# EAGLE schematic ESP32-P4 Display 7.0 inch V1.2 (EAGLE 9.6.2)
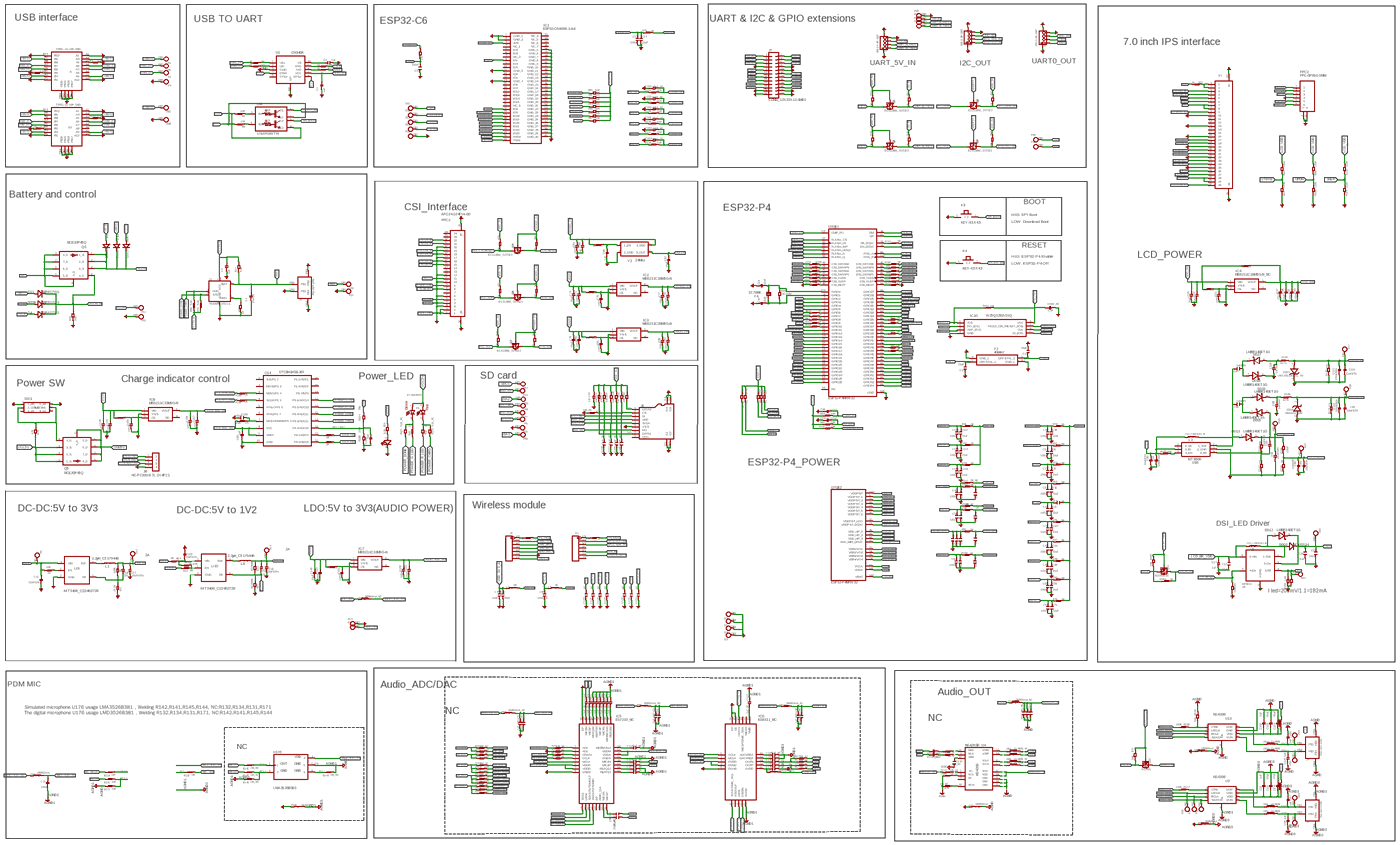
[diagram p0: schematic, sheet 1, overview]
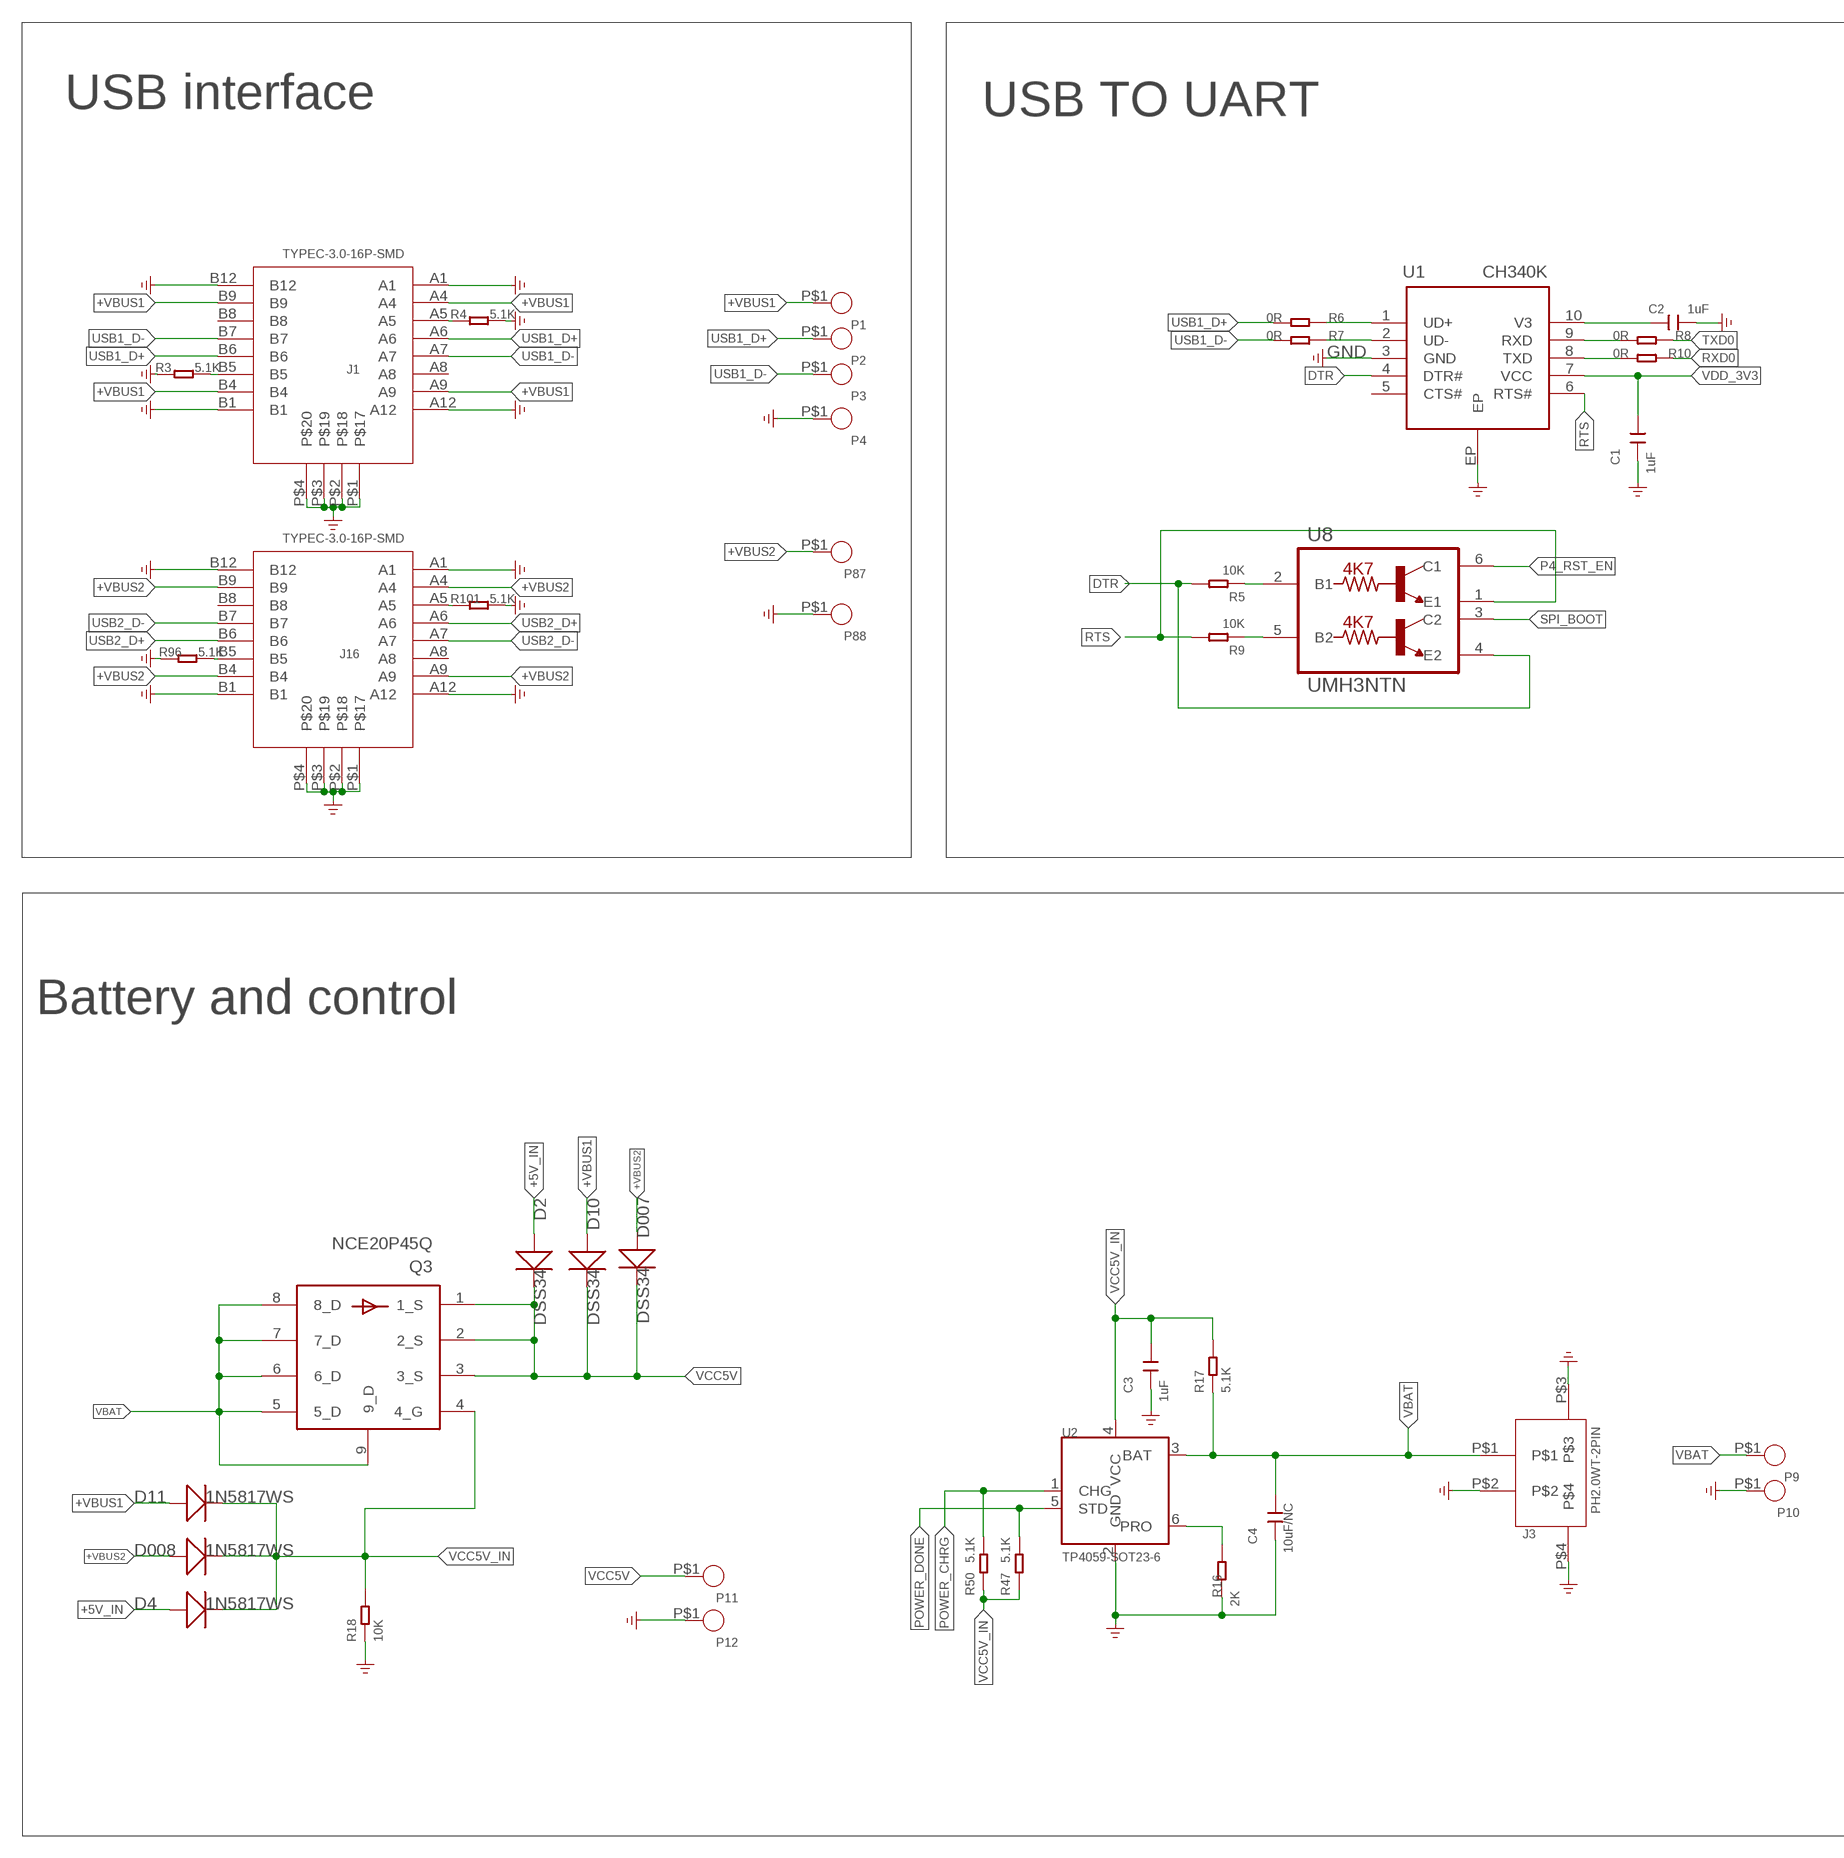
[diagram p1: schematic, sheet 1, part 1 of 8]
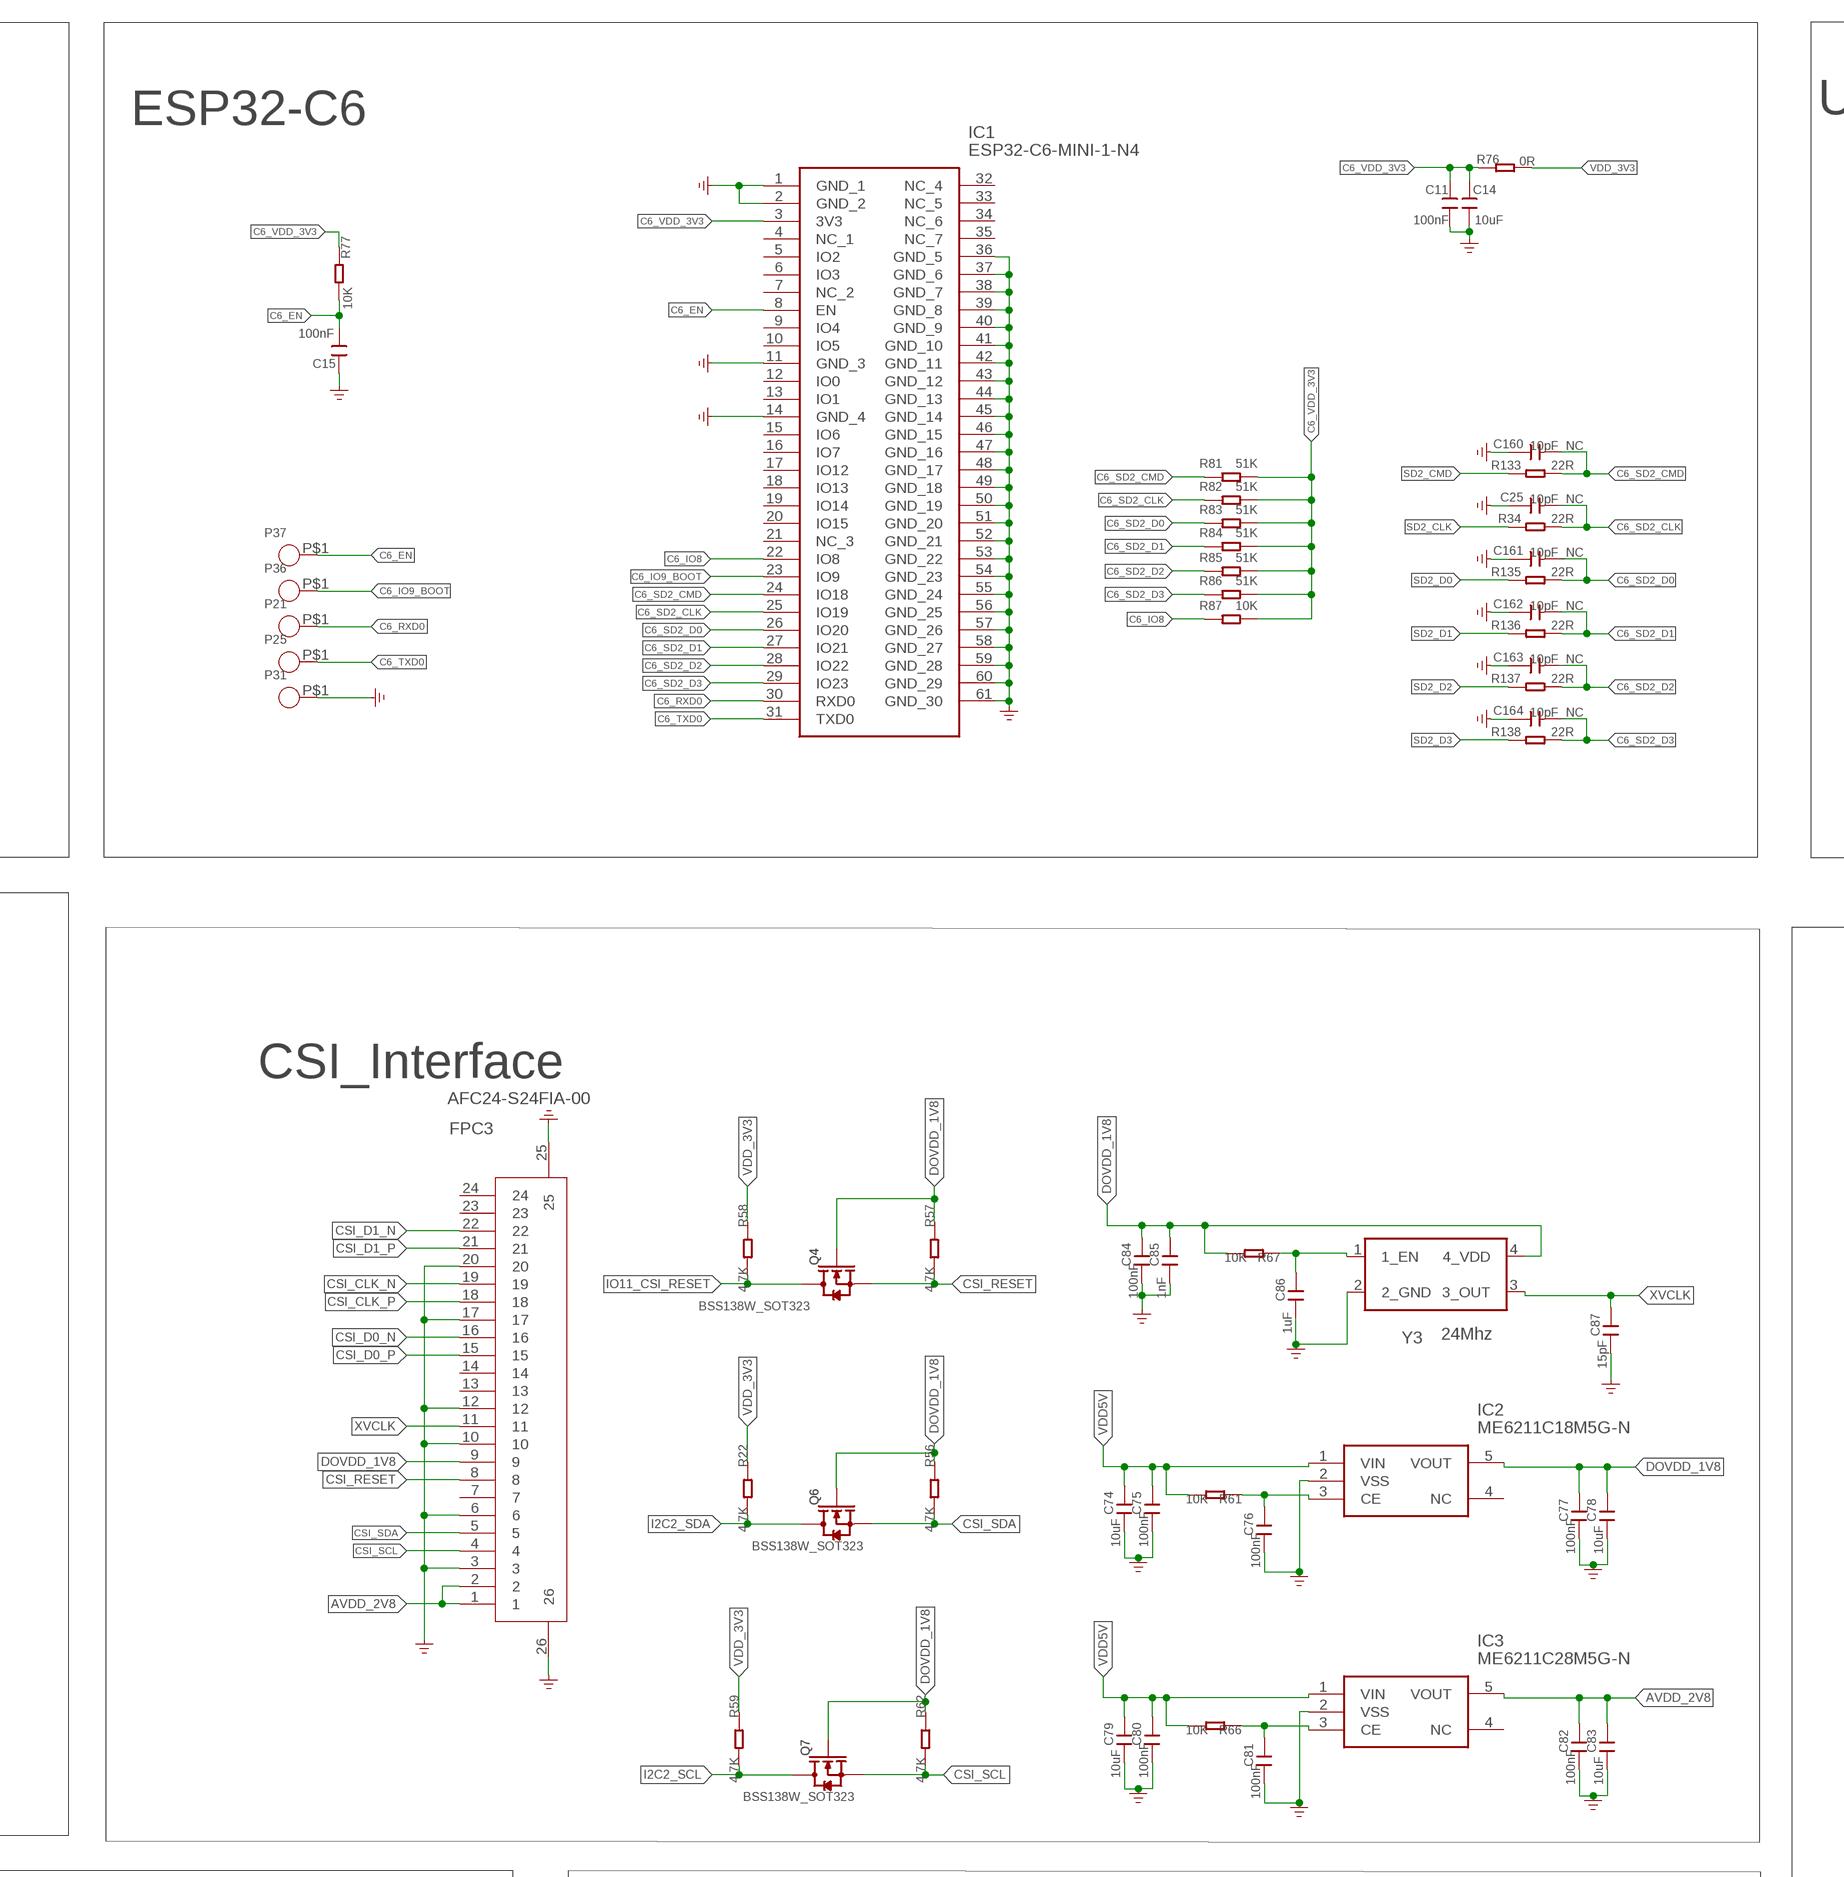
[diagram p2: schematic, sheet 1, part 2 of 8]
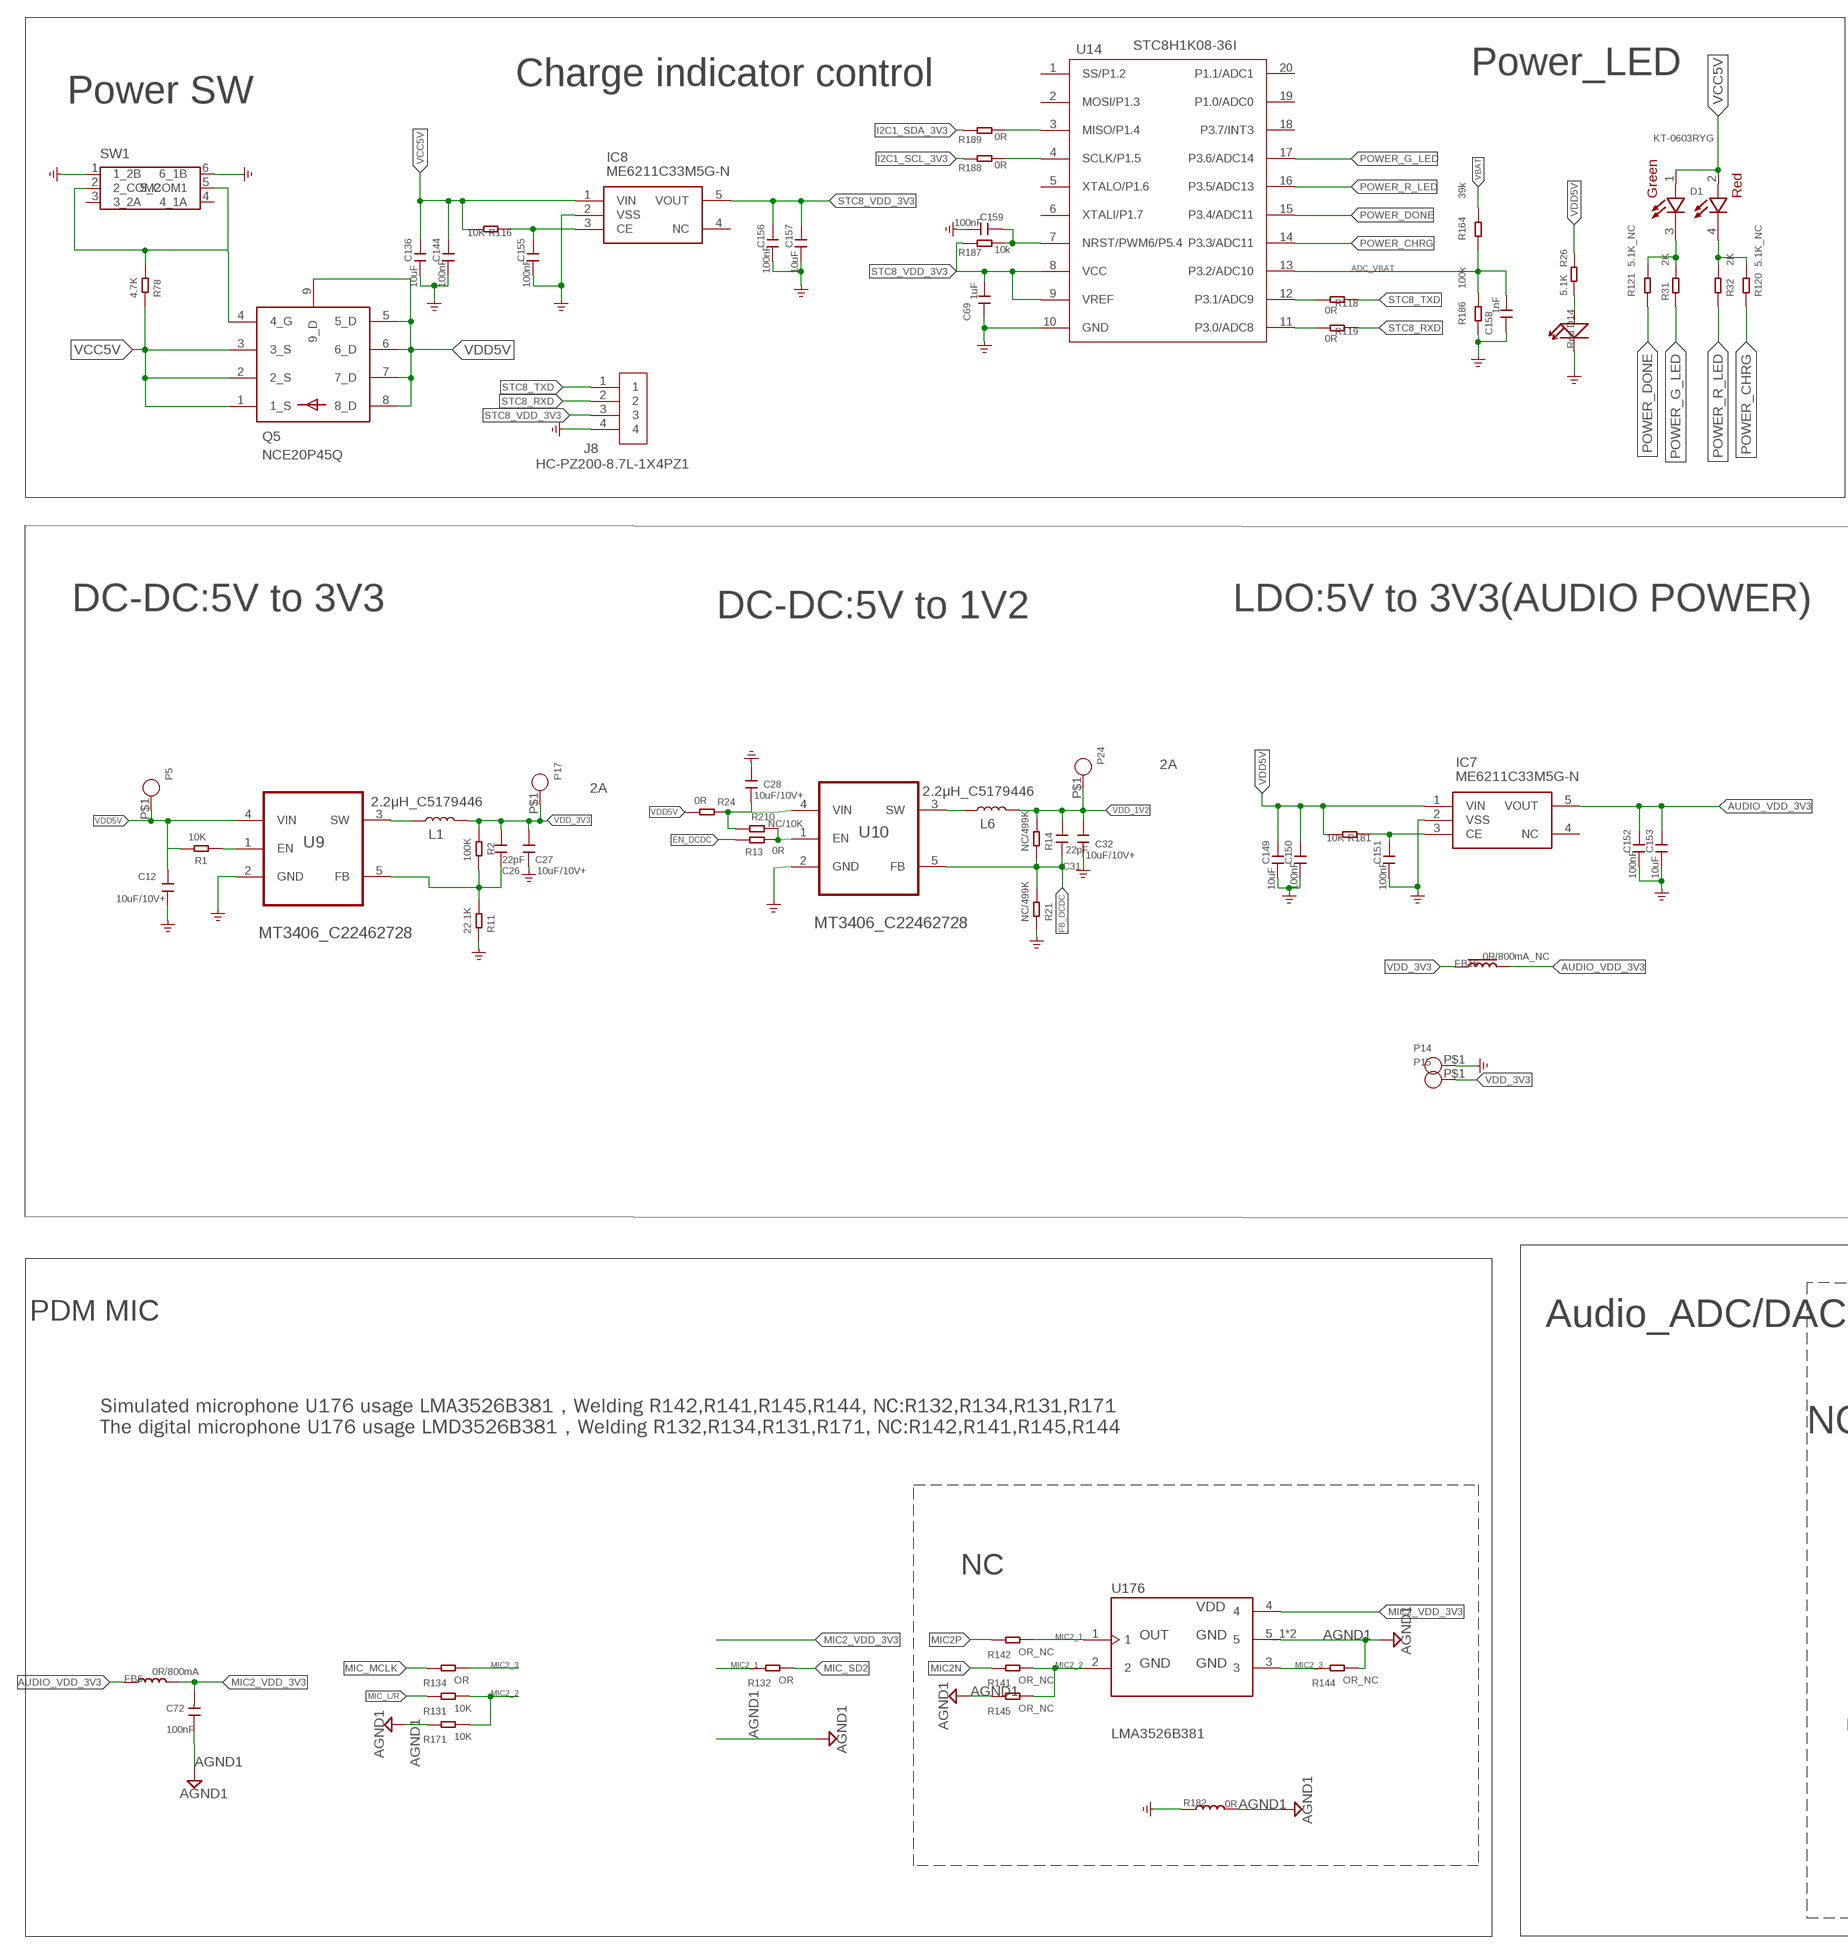
[diagram p3: schematic, sheet 1, part 3 of 8]
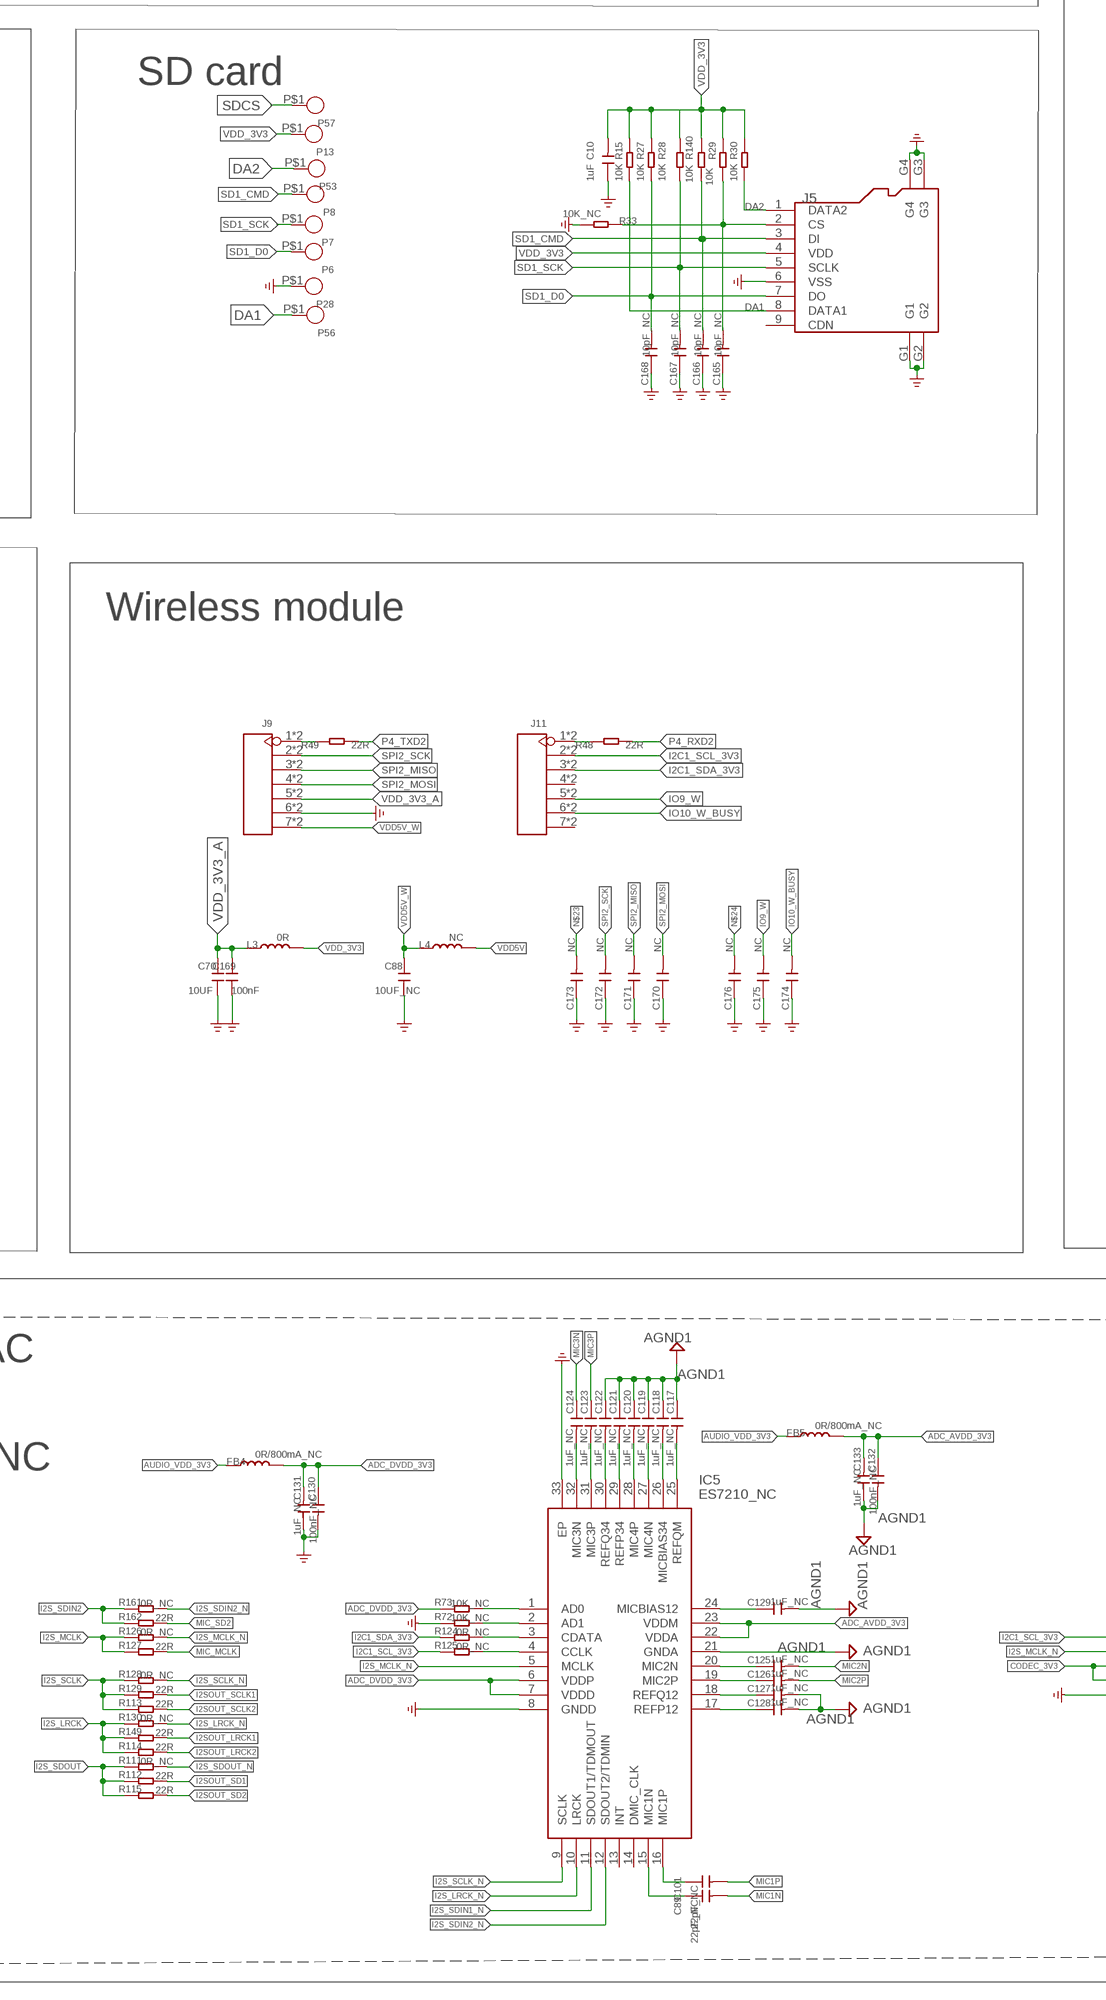
[diagram p4: schematic, sheet 1, part 4 of 8]
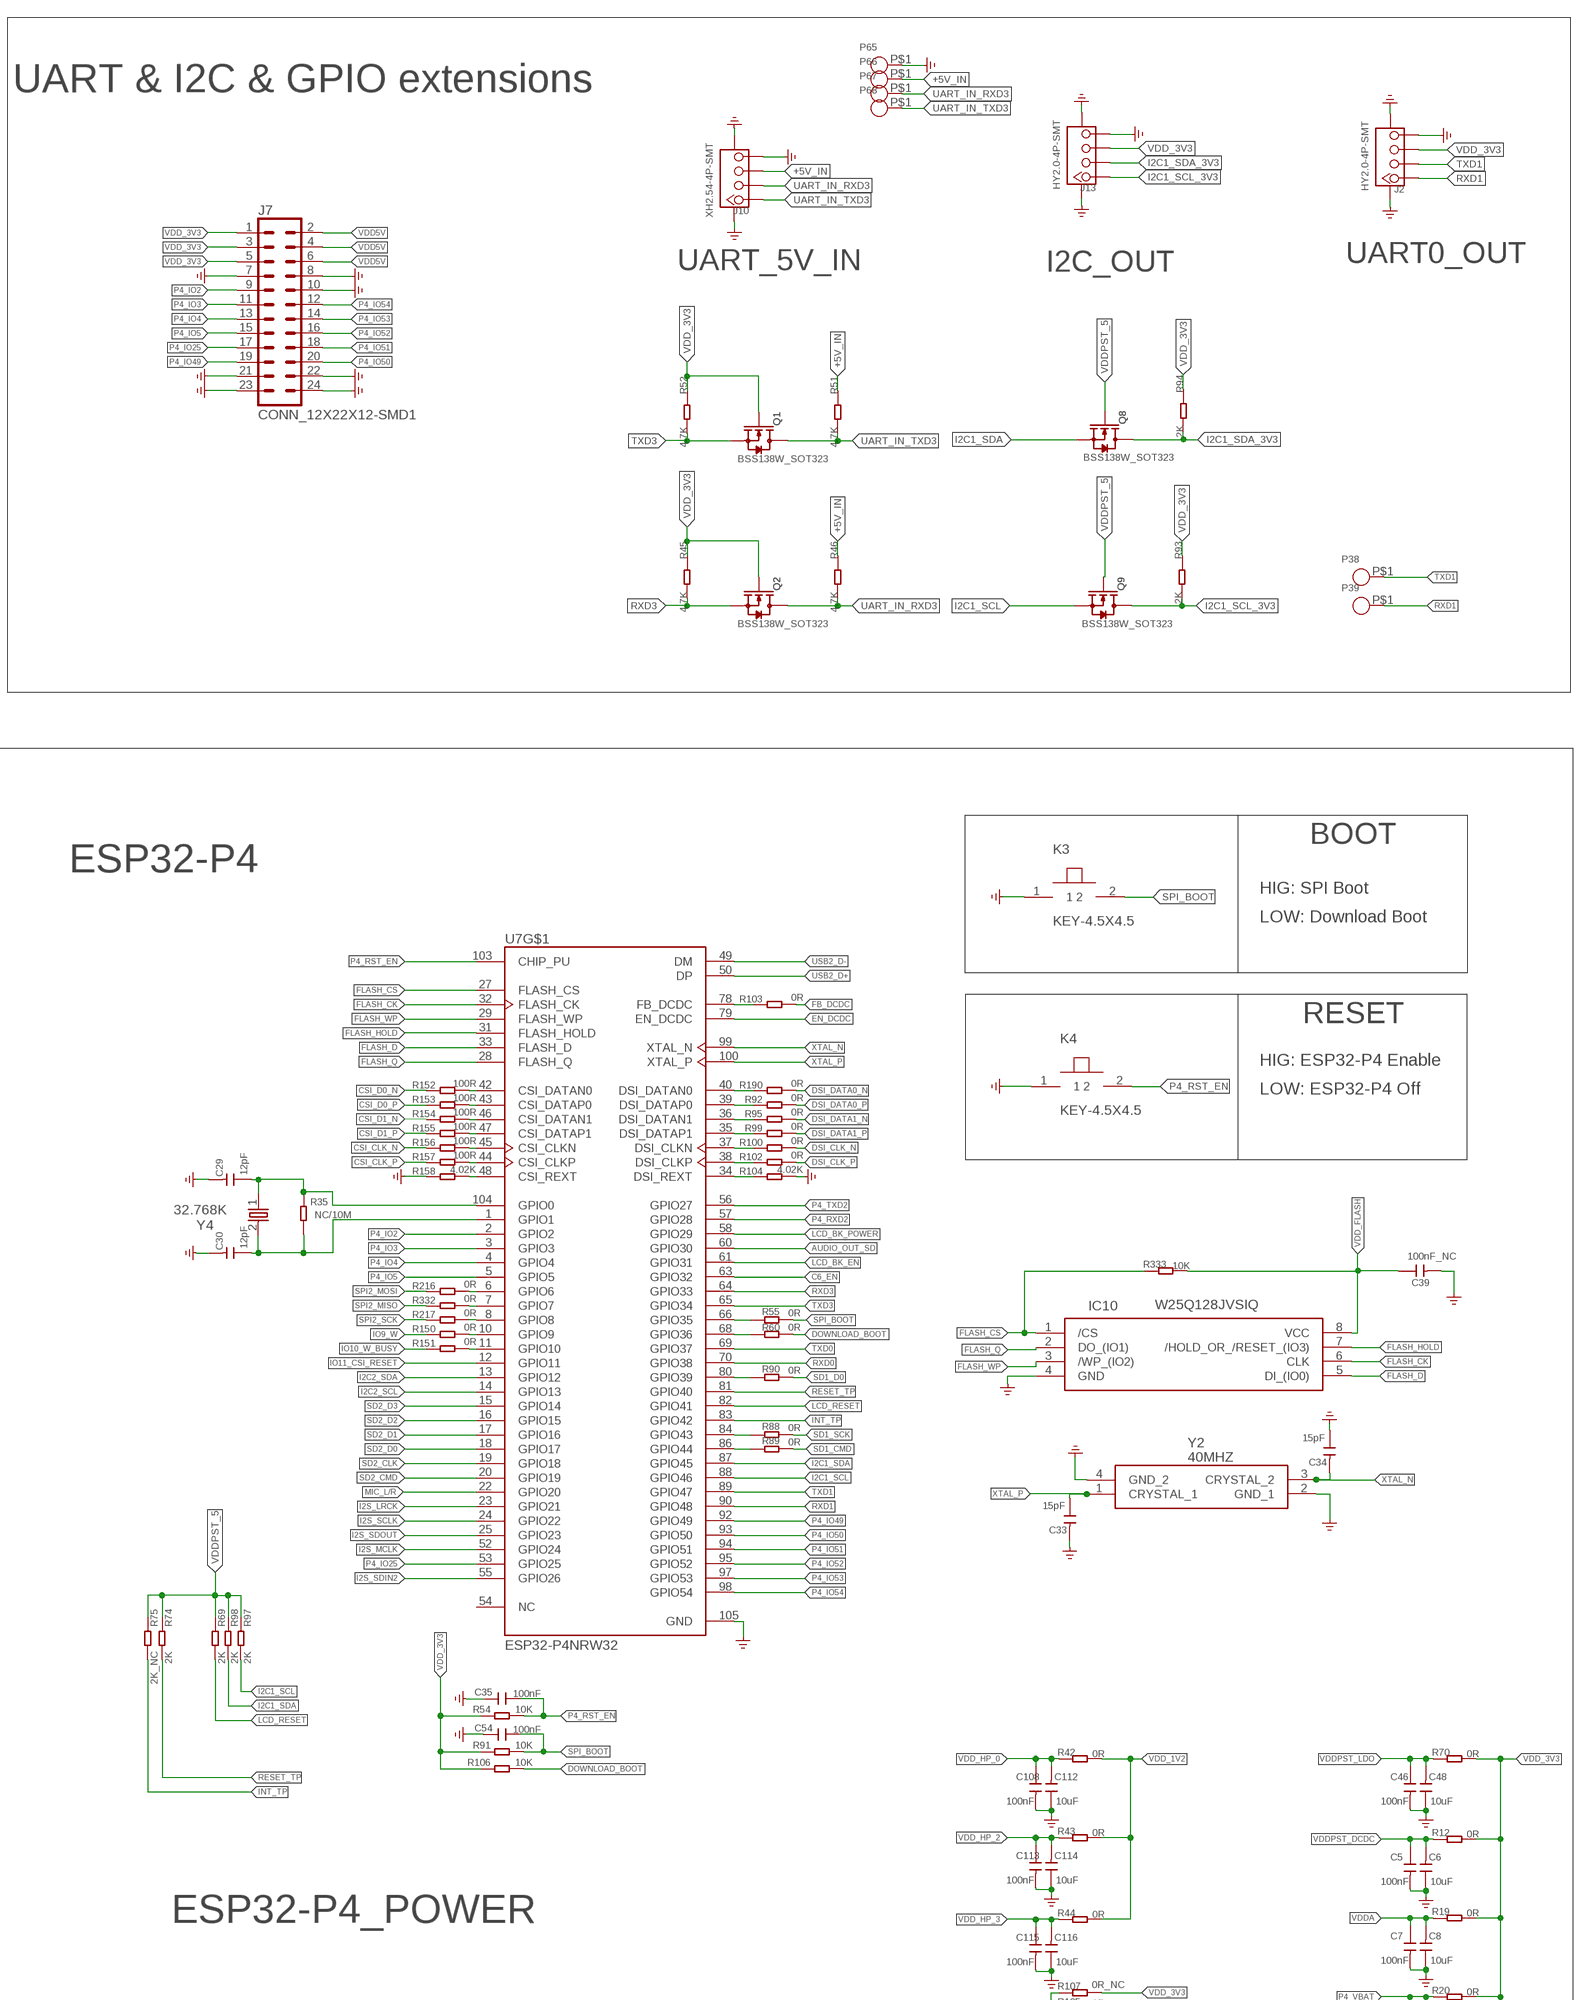
[diagram p5: schematic, sheet 1, part 5 of 8]
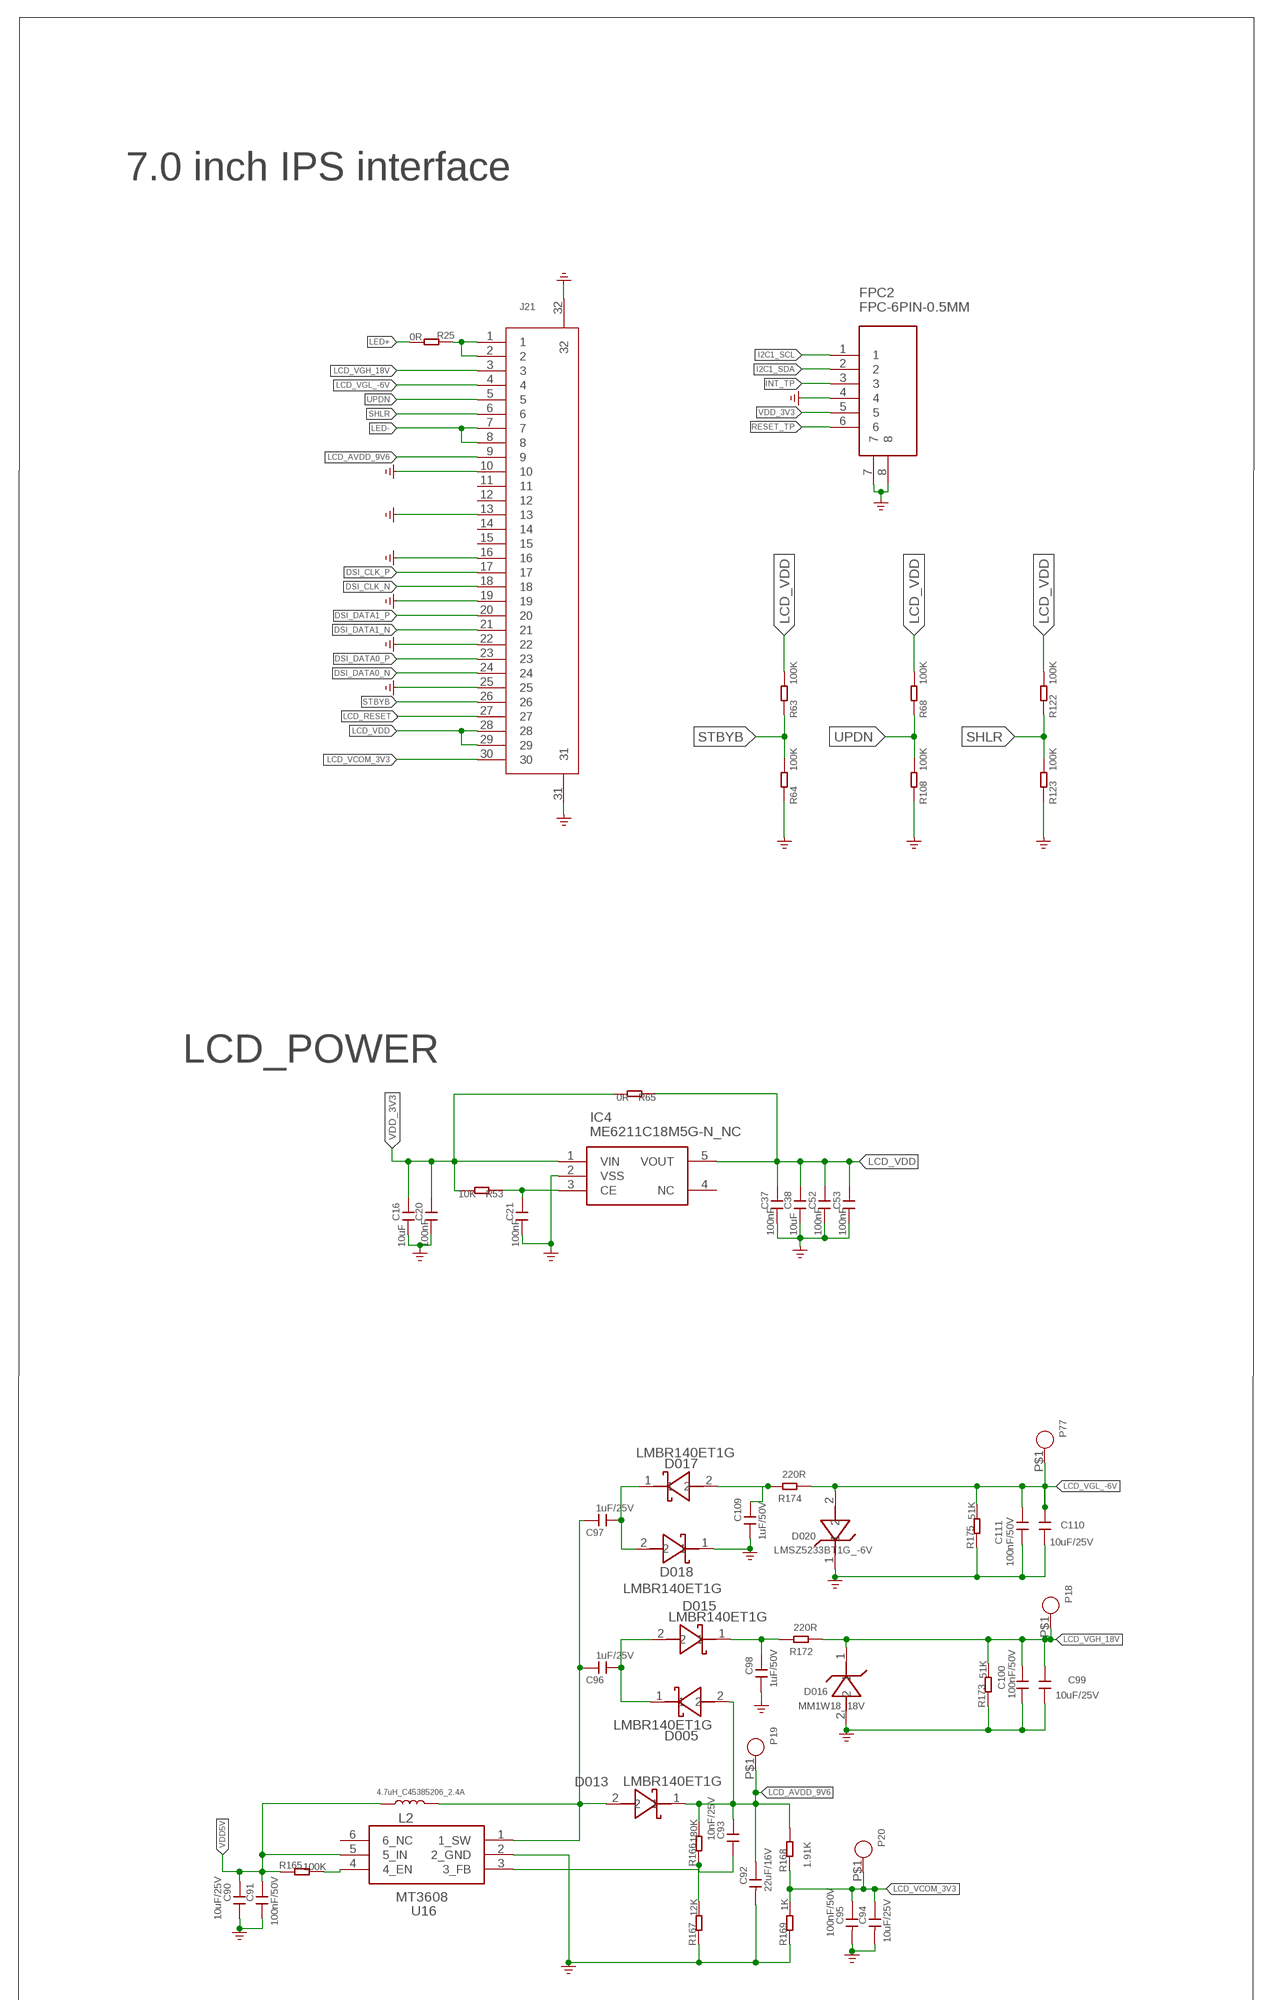
[diagram p6: schematic, sheet 1, part 6 of 8]
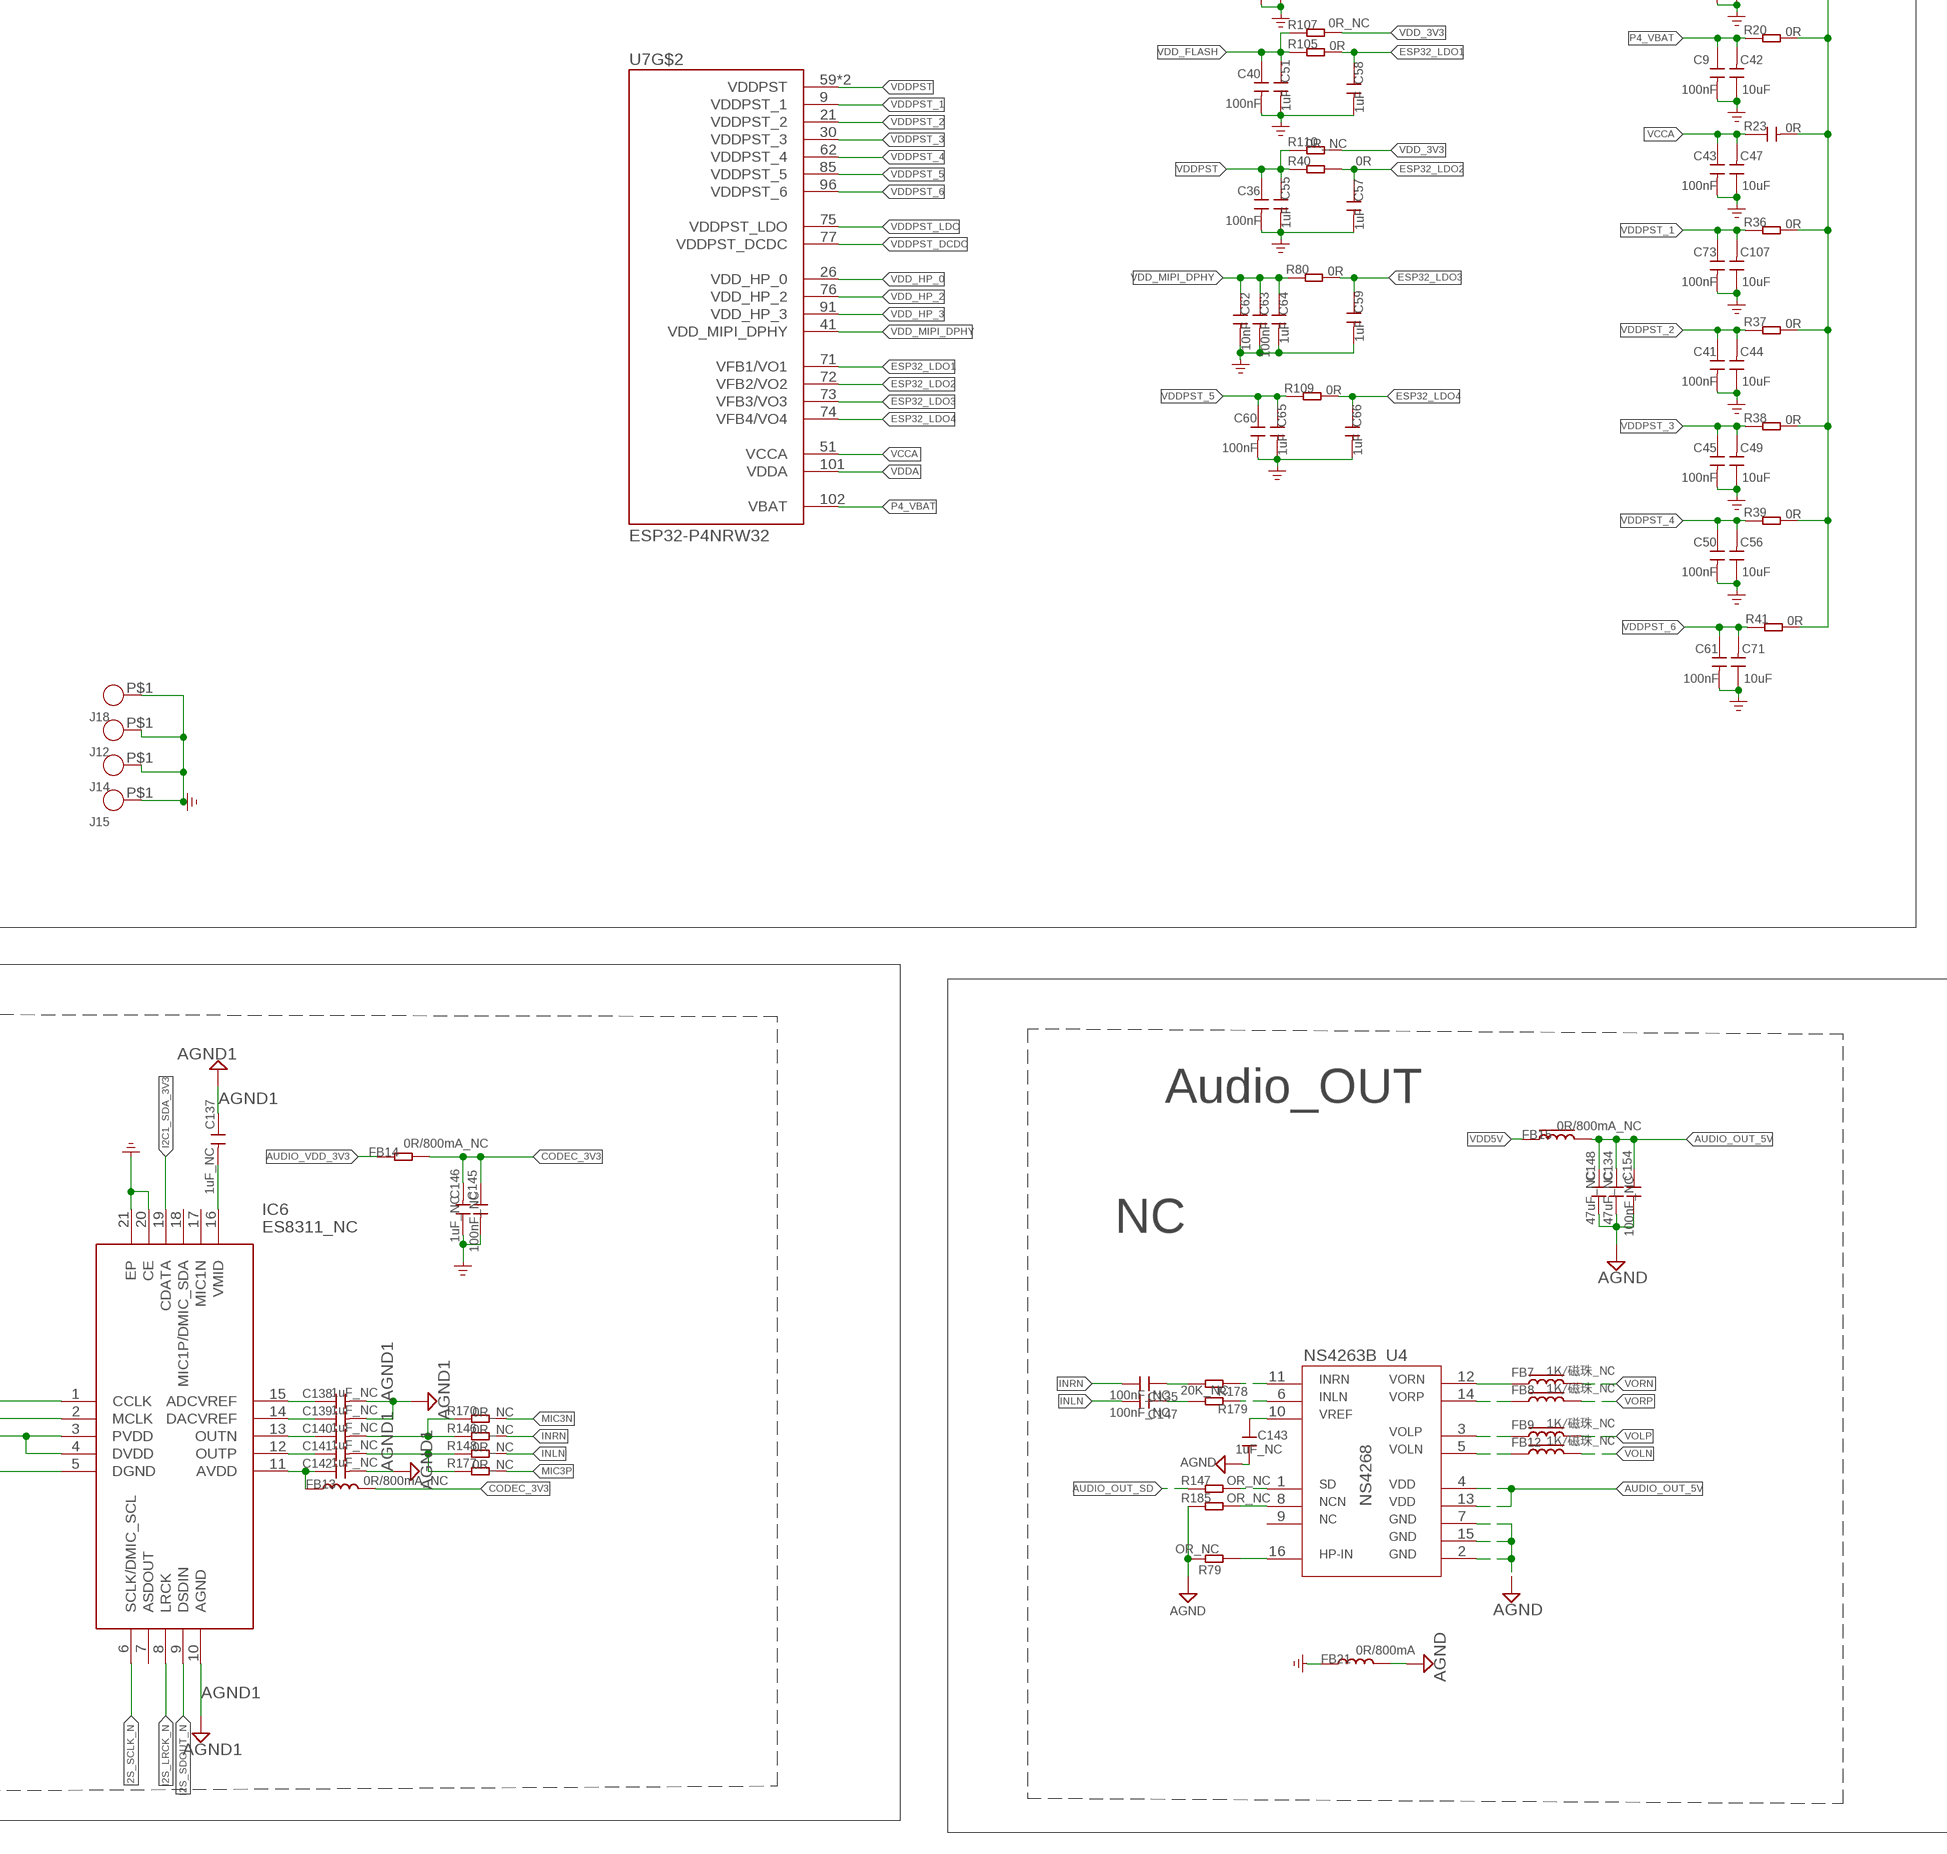
[diagram p7: schematic, sheet 1, part 7 of 8]
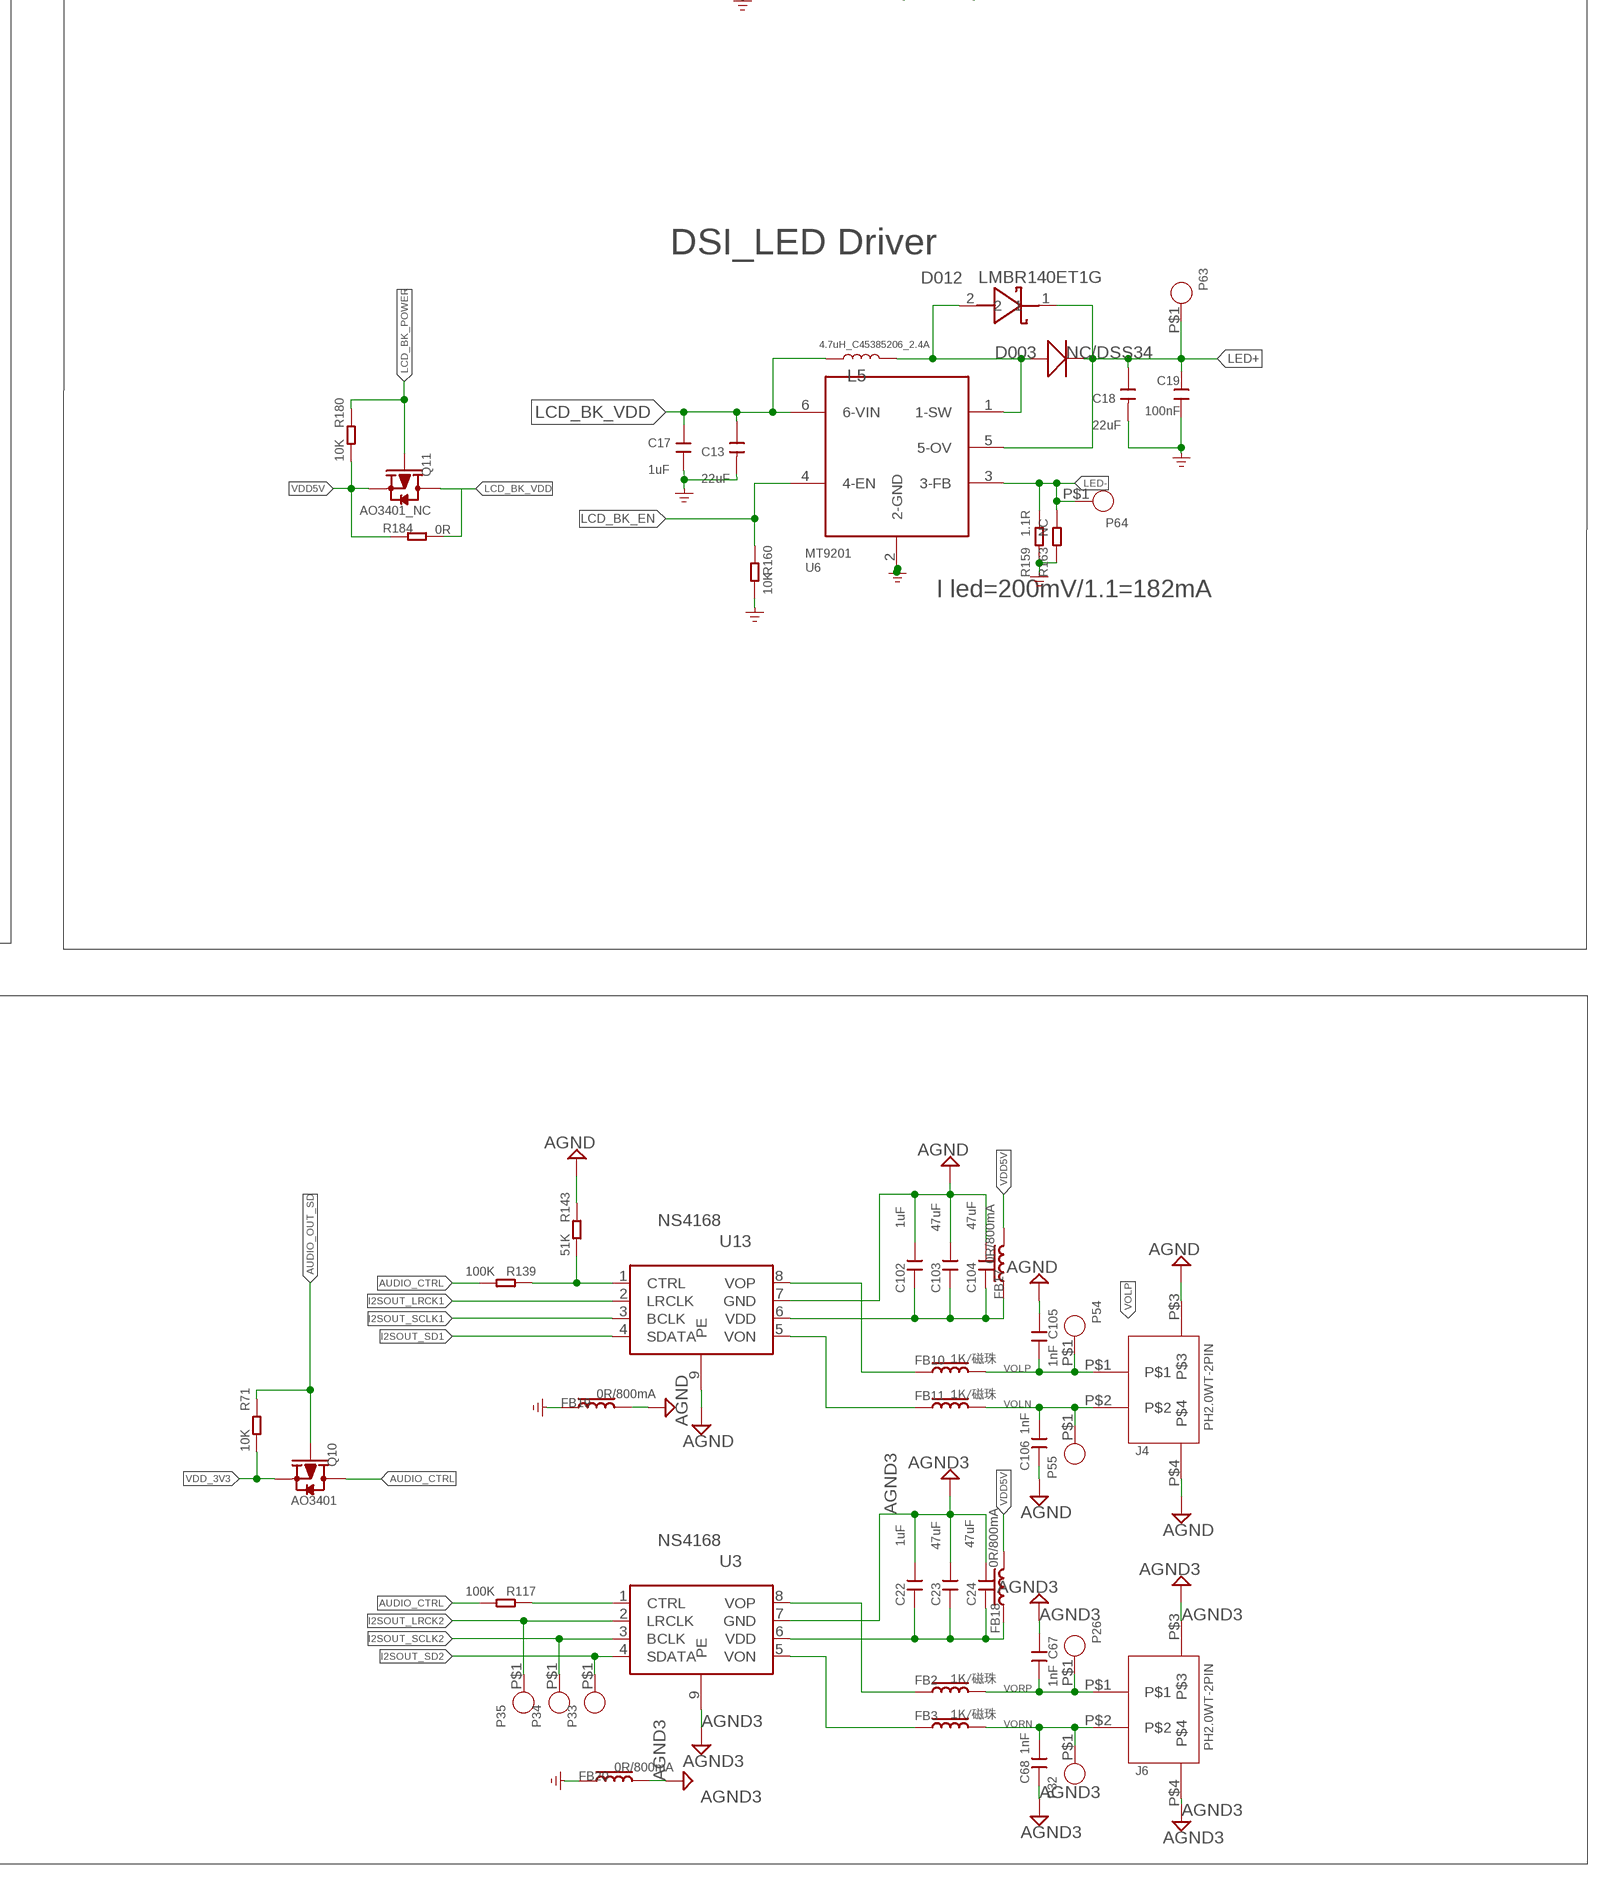
[diagram p8: schematic, sheet 1, part 8 of 8]

## Parts
C1  1uF  C0603  [0603]
C2  1uF  C0603  [0603]
C3  1uF  C0603  [0603]
C4  10uF/NC  C0603  [0603]
C5  100nF  CAPC0402-1  [C0402]
C6  10uF  CAPC0402-1  [C0402]
C7  100nF  CAPC0402-1  [C0402]
C8  10uF  CAPC0402-1  [C0402]
C9  100nF  CAPC0402-1  [C0402]
C10  1uF  CAP-0603  [DISCRETE-NEW_C0603]
C11  100nF  C0603  [0603]
C12  10uF/10V+  C0603  [0603]
C13  22uF  C0805  [C0805]
C14  10uF  C0603  [0603]
C15  100nF  C0603  [0603]
C16  10uF  C0603  [0603]
C17  1uF  C0603  [0603]
C18  22uF  C0805  [C0805]
C19  100nF  C0603  [0603]
C20  100nF  C0603  [0603]
C21  100nF  C0603  [0603]
C22  1uF  C0603  [0603]
C23  47uF  C0603  [0603]
C24  47uF  C0603  [0603]
C25  10pF_NC  CAP  [C0402]
C26  22pF  C0603  [0603]
C27  10uF/10V+  C0603  [0603]
C28  10uF/10V+  C0603  [0603]
C29  12pF  CAPC0402-1  [C0402]
C30  12pF  CAPC0402-1  [C0402]
C31  22pF  C0603  [0603]
C32  10uF/10V+  C0603  [0603]
C33  15pF  CAPC0402-1  [C0402]
C34  15pF  CAPC0402-1  [C0402]
C35  100nF  C0603  [0603]
C36  100nF  CAPC0402-1  [C0402]
C37  100nF  C0603  [0603]
C38  10uF  C0603  [0603]
C39  100nF_NC  CAPC0402-1  [C0402]
C40  100nF  CAPC0402-1  [C0402]
C41  100nF  CAPC0402-1  [C0402]
C42  10uF  CAPC0402-1  [C0402]
C43  100nF  CAPC0402-1  [C0402]
C44  10uF  CAPC0402-1  [C0402]
C45  100nF  CAPC0402-1  [C0402]
C46  100nF  CAPC0402-1  [C0402]
C47  10uF  CAPC0402-1  [C0402]
C48  10uF  CAPC0402-1  [C0402]
C49  10uF  CAPC0402-1  [C0402]
C50  100nF  CAPC0402-1  [C0402]
C51  1uF  CAPC0402-1  [C0402]
C52  100nF  C0603  [0603]
C53  100nF  C0603  [0603]
C54  100nF  C0603  [0603]
C55  1uF  CAPC0402-1  [C0402]
C56  10uF  CAPC0402-1  [C0402]
C57  1uF  CAPC0402-1  [C0402]
C58  1uF  CAPC0402-1  [C0402]
C59  1uF  CAPC0402-1  [C0402]
C60  100nF  CAPC0402-1  [C0402]
C61  100nF  CAPC0402-1  [C0402]
C62  10nF  CAPC0402-1  [C0402]
C63  100nF  CAPC0402-1  [C0402]
C64  1uF  CAPC0402-1  [C0402]
C65  1uF  CAPC0402-1  [C0402]
C66  1uF  CAPC0402-1  [C0402]
C67  1nF  C0603  [0603]
C68  1nF  C0603  [0603]
C69  1uF  C0603  [0603]
C70  10UF  C0603  [0603]
C71  10uF  CAPC0402-1  [C0402]
C72  100nF  CAPC0402-1  [C0402]
C73  100nF  CAPC0402-1  [C0402]
C74  10uF  C0603  [0603]
C75  100nF  C0603  [0603]
C76  100nF  C0603  [0603]
C77  100nF  C0603  [0603]
C78  10uF  C0603  [0603]
C79  10uF  C0603  [0603]
C80  100nF  C0603  [0603]
C81  100nF  C0603  [0603]
C82  100nF  C0603  [0603]
C83  10uF  C0603  [0603]
C84  100nF  C0603  [0603]
C85  1nF  C0603  [0603]
C86  1uF  C0603  [0603]
C87  15pF  C0603  [0603]
C88  10UF_NC  C0603  [0603]
C89  22pF_NC  CAPC0402-1  [C0402]
C90  10uF/25V  C0603  [0603]
C91  100nF/50V  C0603  [0603]
C92  22uF/16V  C0805  [C0805]
C93  10nF/25V  C0603  [0603]
C94  10uF/25V  CAPC0402-1  [C0402]
C95  100nF/50V  CAPC0402-1  [C0402]
C96  1uF/25V  C0603  [0603]
C97  1uF/25V  C0603  [0603]
C98  1uF/50V  C0603  [0603]
C99  10uF/25V  C0603  [0603]
C100  100nF/50V  C0603  [0603]
C101  22pF_NC  CAPC0402-1  [C0402]
C102  1uF  C0603  [0603]
C103  47uF  C0603  [0603]
C104  47uF  C0603  [0603]
C105  1nF  C0603  [0603]
C106  1nF  C0603  [0603]
C107  10uF  CAPC0402-1  [C0402]
C108  100nF  CAPC0402-1  [C0402]
C109  1uF/50V  C0603  [0603]
C110  10uF/25V  C0603  [0603]
C111  100nF/50V  C0603  [0603]
C112  10uF  CAPC0402-1  [C0402]
C113  100nF  CAPC0402-1  [C0402]
C114  10uF  CAPC0402-1  [C0402]
C115  100nF  CAPC0402-1  [C0402]
C116  10uF  CAPC0402-1  [C0402]
C117  1uF_NC  CAPC0402-1  [C0402]
C118  1uF_NC  CAPC0402-1  [C0402]
C119  1uF_NC  CAPC0402-1  [C0402]
C120  1uF_NC  CAPC0402-1  [C0402]
C121  1uF_NC  CAPC0402-1  [C0402]
C122  1uF_NC  CAPC0402-1  [C0402]
C123  1uF_NC  CAPC0402-1  [C0402]
C124  1uF_NC  CAPC0402-1  [C0402]
C125  1uF_NC  CAPC0402-1  [C0402]
C126  1uF_NC  CAPC0402-1  [C0402]
C127  1uF_NC  CAPC0402-1  [C0402]
C128  1uF_NC  CAPC0402-1  [C0402]
C129  1uF_NC  CAPC0402-1  [C0402]
C130  100nF_NC  CAPC0402-1  [C0402]
C131  1uF_NC  CAPC0402-1  [C0402]
C132  100nF_NC  CAPC0402-1  [C0402]
C133  1uF_NC  CAPC0402-1  [C0402]
C134  47uF_NC  C0603  [0603]
C135  100nF_NC  C0603  [0603]
C136  10uF  C0603  [0603]
C137  1uF_NC  CAPC0402-1  [C0402]
C138  1uF_NC  CAPC0402-1  [C0402]
C139  1uF_NC  CAPC0402-1  [C0402]
C140  1uF_NC  CAPC0402-1  [C0402]
C141  1uF_NC  CAPC0402-1  [C0402]
C142  1uF_NC  CAPC0402-1  [C0402]
C143  1uF_NC  C0603  [0603]
C144  100nF  C0603  [0603]
C145  100nF_NC  CAPC0402-1  [C0402]
C146  1uF_NC  CAPC0402-1  [C0402]
C147  100nF_NC  C0603  [0603]
C148  47uF_NC  C0603  [0603]
C149  10uF  C0603  [0603]
C150  100nF  C0603  [0603]
C151  100nF  C0603  [0603]
C152  100nF  C0603  [0603]
C153  10uF  C0603  [0603]
C154  100nF_NC  C0603  [0603]
C155  100nF  C0603  [0603]
C156  100nF  C0603  [0603]
C157  10uF  C0603  [0603]
C158  1nF  C0603  [0603]
C159  100nF  C0603  [0603]
C160  10pF_NC  CAP  [C0402]
C161  10pF_NC  CAP  [C0402]
C162  10pF_NC  CAP  [C0402]
C163  10pF_NC  CAP  [C0402]
C164  10pF_NC  CAP  [C0402]
C165  10pF_NC  CAP-0402  [C0402]
C166  10pF_NC  CAP-0402  [C0402]
C167  10pF_NC  CAP-0402  [C0402]
C168  10pF_NC  CAP-0402  [C0402]
C169  100nF  C0603  [0603]
C170  NC  CAP  [C0402]
C171  NC  CAP  [C0402]
C172  NC  CAP  [C0402]
C173  NC  CAP  [C0402]
C174  NC  CAP  [C0402]
C175  NC  CAP  [C0402]
C176  NC  CAP  [C0402]
D1  KT-0603RYG  [LED_KT-0603RYG]
D2  DSS34  DIODE  [D_SOD123FL]
D003  NC/DSS34  DIODE  [D_SOD123FL]
D4  1N5817WS  DIODE0805  [D_SOD323]
D005  LMBR140ET1G  [LMBR140ET1G]
D007  DSS34  DIODE  [D_SOD123FL]
D008  1N5817WS  DIODE0805  [D_SOD323]
D10  DSS34  DIODE  [D_SOD123FL]
D11  1N5817WS  DIODE0805  [D_SOD323]
D012  LMBR140ET1G  [LMBR140ET1G]
D013  LMBR140ET1G  [LMBR140ET1G]
D14  Red  LED-SMT0603  [LED0603]
D015  LMBR140ET1G  [LMBR140ET1G]
D016  MM1W18_18V  LMSZ5233BT1G  [LMSZ5233BT1G]
D017  LMBR140ET1G  [LMBR140ET1G]
D018  LMBR140ET1G  [LMBR140ET1G]
D020  LMSZ5233BT1G_-6V  LMSZ5233BT1G  [LMSZ5233BT1G]
FB2  1K/磁珠  FBL0603  [L0603]
FB3  1K/磁珠  FBL0603  [L0603]
FB4  0R/800mA_NC  L0402  [L0402]
FB5  0R/800mA_NC  L0402  [L0402]
FB6  0R/800mA  L0402  [L0402]
FB7  1K/磁珠_NC  FBL0603  [L0603]
FB8  1K/磁珠_NC  FBL0603  [L0603]
FB9  1K/磁珠_NC  FBL0603  [L0603]
FB10  1K/磁珠  FBL0603  [L0603]
FB11  1K/磁珠  FBL0603  [L0603]
FB12  1K/磁珠_NC  FBL0603  [L0603]
FB13  0R/800mA_NC  L0402  [L0402]
FB14  0R/800mA_NC  RES-0402  [R0402]
FB15  0R/800mA_NC  FBL0603  [L0603]
FB16  0R/800mA_NC  FBL0603  [L0603]
FB17  0R/800mA  FBL0603  [L0603]
FB18  0R/800mA  FBL0603  [L0603]
FB19  0R/800mA  FBL0603  [L0603]
FB20  0R/800mA  FBL0603  [L0603]
FB21  0R/800mA  L0805  [L0805]
FPC2  FPC-6PIN-0.5MM  [FPC-6PIN-0.5MM]
FPC3  AFC24-S24FIA-00  [FPC-SMD_P0.50-24P_QCHF-SM-H2.0]
IC1  ESP32-C6-MINI-1-N4  [ESP32C6MINI1N4]
IC2  ME6211C18M5G-N  [SOT95P282X145-5N]
IC3  ME6211C28M5G-N  ME6211C18M5G-N  [SOT95P282X145-5N]
IC4  ME6211C18M5G-N_NC  ME6211C18M5G-N  [SOT95P282X145-5N]
IC5  ES7210_NC  ES7210  [QFN40P400X400X80-33N]
IC6  ES8311_NC  ES8311  [QFN40P300X300X60-21N]
IC7  ME6211C33M5G-N  ME6211C18M5G-N  [SOT95P282X145-5N]
IC8  ME6211C33M5G-N  ME6211C18M5G-N  [SOT95P282X145-5N]
IC10  W25Q128JVSIQ  [SOIC127P790X216-8N]
J1  TYPEC-3.0-16P-SMD  [USB-3.0TYPEC-SMD]
J2  HY2.0-4P-SMT  CONNECTOR_TWIG-4P-2.0-SMD-FEMALE-REINFORCEDD  [CONNECTOR_4P-SMD-2.0]
J3  PH2.0WT-2PIN  [PH2.0WT-2PIN]
J4  PH2.0WT-2PIN  [PH2.0WT-2PIN]
J5  HOLDER-MICROSD-9P  [9P-SMD-W/-RING]
J6  PH2.0WT-2PIN  [PH2.0WT-2PIN]
J7  CONN_12X22X12-SMD1  [2X12-SMD1]
J8  HC-PZ200-8.7L-1X4PZ1  [TEST-PIN-4-2.0MM]
J9  HEADER-7P-18.28X2.5  [H7-2.54-18.28X2.5X5MM]
J10  XH2.54-4P-SMT  [XH2.54-4P-SMD]
J11  HEADER-7P-18.28X2.5  [H7-2.54-18.28X2.5X5MM]
J12  THO-M3.25MM-HOLE  [THO-M3.2*5MM-HOLE]
J13  HY2.0-4P-SMT  CONNECTOR_TWIG-4P-2.0-SMD-FEMALE-REINFORCEDD  [CONNECTOR_4P-SMD-2.0]
J14  THO-M3.25MM-HOLE  [THO-M3.2*5MM-HOLE]
J15  THO-M3.25MM-HOLE  [THO-M3.2*5MM-HOLE]
J16  TYPEC-3.0-16P-SMD  [USB-3.0TYPEC-SMD]
J18  THO-M3.25MM-HOLE  [THO-M3.2*5MM-HOLE]
J21  C23398852_30P_0.5MM_下接_FC-05A30P11H20  [C23398852_30P_0.5MM_下接_FC-05A30P11H20]
K3  KEY-4.5X4.5  KEY-6KEY-4.5X4.5  [KEY-4.5X4.5-SMD]
K4  KEY-4.5X4.5  KEY-6KEY-4.5X4.5  [KEY-4.5X4.5-SMD]
L1  2.2μH_C5179446  4.7μH_SHIELDED_INDUCTOR  [1008(2520)]
L2  4.7uH_C45385206_2.4A  4.7μH_SHIELDED_INDUCTOR  [1008(2520)]
L3  0R  L0603  [L0603]
L4  NC  L0603  [L0603]
L5  4.7uH_C45385206_2.4A  4.7μH_SHIELDED_INDUCTOR  [1008(2520)]
L6  2.2μH_C5179446  4.7μH_SHIELDED_INDUCTOR  [1008(2520)]
P1  TEST_PADPAD-1.5MM  [TEST_PAD-1.5MM]
P2  TEST_PADPAD-1.5MM  [TEST_PAD-1.5MM]
P3  TEST_PADPAD-1.5MM  [TEST_PAD-1.5MM]
P4  TEST_PADPAD-1.5MM  [TEST_PAD-1.5MM]
P5  TEST_PADPAD-1.5MM  [TEST_PAD-1.5MM]
P6  TEST_PADPAD-1.5MM  [TEST_PAD-1.5MM]
P7  TEST_PADPAD-1.5MM  [TEST_PAD-1.5MM]
P8  TEST_PADPAD-1.5MM  [TEST_PAD-1.5MM]
P9  TEST_PADPAD-1.5MM  [TEST_PAD-1.5MM]
P10  TEST_PADPAD-1.5MM  [TEST_PAD-1.5MM]
P11  TEST_PADPAD-1.5MM  [TEST_PAD-1.5MM]
P12  TEST_PADPAD-1.5MM  [TEST_PAD-1.5MM]
P13  TEST_PADPAD-1.5MM  [TEST_PAD-1.5MM]
P14  TEST_PADPAD-1.5MM  [TEST_PAD-1.5MM]
P15  TEST_PADPAD-1.5MM  [TEST_PAD-1.5MM]
P17  TEST_PADPAD-1.5MM  [TEST_PAD-1.5MM]
P18  TEST_PADPAD-1.5MM  [TEST_PAD-1.5MM]
P19  TEST_PADPAD-1.5MM  [TEST_PAD-1.5MM]
P20  TEST_PADPAD-1.5MM  [TEST_PAD-1.5MM]
P21  TEST_PADPAD-1.5MM  [TEST_PAD-1.5MM]
P24  TEST_PADPAD-1.5MM  [TEST_PAD-1.5MM]
P25  TEST_PADPAD-1.5MM  [TEST_PAD-1.5MM]
P26  TEST_PADPAD-1.5MM  [TEST_PAD-1.5MM]
P28  TEST_PADPAD-1.5MM  [TEST_PAD-1.5MM]
P31  TEST_PADPAD-1.5MM  [TEST_PAD-1.5MM]
P32  TEST_PADPAD-1.5MM  [TEST_PAD-1.5MM]
P33  TEST_PADPAD-1.5MM  [TEST_PAD-1.5MM]
P34  TEST_PADPAD-1.5MM  [TEST_PAD-1.5MM]
P35  TEST_PADPAD-1.5MM  [TEST_PAD-1.5MM]
P36  TEST_PADPAD-1.5MM  [TEST_PAD-1.5MM]
P37  TEST_PADPAD-1.5MM  [TEST_PAD-1.5MM]
P38  TEST_PADPAD-1.5MM  [TEST_PAD-1.5MM]
P39  TEST_PADPAD-1.5MM  [TEST_PAD-1.5MM]
P53  TEST_PADPAD-1.5MM  [TEST_PAD-1.5MM]
P54  TEST_PADPAD-1.5MM  [TEST_PAD-1.5MM]
P55  TEST_PADPAD-1.5MM  [TEST_PAD-1.5MM]
P56  TEST_PADPAD-1.5MM  [TEST_PAD-1.5MM]
P57  TEST_PADPAD-1.5MM  [TEST_PAD-1.5MM]
P63  TEST_PADPAD-1.5MM  [TEST_PAD-1.5MM]
P64  TEST_PADPAD-1.5MM  [TEST_PAD-1.5MM]
P65  TEST_PADPAD-1.5MM  [TEST_PAD-1.5MM]
P66  TEST_PADPAD-1.5MM  [TEST_PAD-1.5MM]
P67  TEST_PADPAD-1.5MM  [TEST_PAD-1.5MM]
P68  TEST_PADPAD-1.5MM  [TEST_PAD-1.5MM]
P77  TEST_PADPAD-1.5MM  [TEST_PAD-1.5MM]
P87  TEST_PADPAD-1.5MM  [TEST_PAD-1.5MM]
P88  TEST_PADPAD-1.5MM  [TEST_PAD-1.5MM]
Q1  BSS138W_SOT323  MOSFET-NSI1304BDL  [MOS_SOT323]
Q2  BSS138W_SOT323  MOSFET-NSI1304BDL  [MOS_SOT323]
Q3  NCE20P45Q  RU30L30M  [PDFN3333]
Q4  BSS138W_SOT323  MOSFET-NSI1304BDL  [MOS_SOT323]
Q5  NCE20P45Q  RU30L30M  [PDFN3333]
Q6  BSS138W_SOT323  MOSFET-NSI1304BDL  [MOS_SOT323]
Q7  BSS138W_SOT323  MOSFET-NSI1304BDL  [MOS_SOT323]
Q8  BSS138W_SOT323  MOSFET-NSI1304BDL  [MOS_SOT323]
Q9  BSS138W_SOT323  MOSFET-NSI1304BDL  [MOS_SOT323]
Q10  AO3401  MOSFET-PSOT23  [PMOS_SOT23]
Q11  AO3401_NC  MOSFET-PSOT23  [PMOS_SOT23]
R1  10K  R0603  [R0603@1]
R2  100K  R0603  [R0603@1]
R3  5.1K  R0603  [R0603@1]
R4  5.1K  R0603  [R0603@1]
R5  10K  R0603  [R0603@1]
R6  0R  R0603  [R0603@1]
R7  0R  R0603  [R0603@1]
R8  0R  R0603  [R0603@1]
R9  10K  R0603  [R0603@1]
R10  0R  R0603  [R0603@1]
R11  22.1K  R0603  [R0603]
R12  0R  RES-0402  [R0402]
R13  0R  R0603  [R0603@1]
R14  NC/499K  R0603  [R0603]
R15  10K  R  [0402]
R16  2K  RES-0603  [R0603-SP]
R17  5.1K  R0603  [R0603@1]
R18  10K  R0603  [R0603@1]
R19  0R  RES-0402  [R0402]
R20  0R  RES-0402  [R0402]
R21  NC/499K  R0603  [R0603]
R22  4.7K  R0603  [R0603@1]
R23  0R  CAPC0402-1  [C0402]
R24  0R  R0603  [R0603@1]
R25  0R  RES-0603  [R0603-SP]
R26  5.1K  R0603  [R0603@1]
R27  10K  R  [0402]
R28  10K  R  [0402]
R29  10K  R  [0402]
R30  10K  R  [0402]
R31  2K  RES-0603  [R0603-SP]
R32  2K  RES-0603  [R0603-SP]
R33  10K_NC  R  [0402]
R34  22R  R  [0402]
R35  NC/10M  RES-0402  [R0402]
R36  0R  RES-0402  [R0402]
R37  0R  RES-0402  [R0402]
R38  0R  RES-0402  [R0402]
R39  0R  RES-0402  [R0402]
R40  0R  RES-0402  [R0402]
R41  0R  RES-0402  [R0402]
R42  0R  RES-0402  [R0402]
R43  0R  RES-0402  [R0402]
R44  0R  RES-0402  [R0402]
R45  4.7K  R0603  [R0603@1]
R46  4.7K  R0603  [R0603@1]
R47  5.1K  R0603  [R0603@1]
R48  22R  R  [0402]
R49  22R  R  [0402]
R50  5.1K  R0603  [R0603@1]
R51  4.7K  R0603  [R0603@1]
R52  4.7K  R0603  [R0603@1]
R53  10K  R0603  [R0603@1]
R54  10K  R0603  [R0603@1]
R55  0R  R0603  [R0603@1]
R56  4.7K  R0603  [R0603@1]
R57  4.7K  R0603  [R0603@1]
R58  4.7K  R0603  [R0603@1]
R59  4.7K  R0603  [R0603@1]
R60  0R  R0603  [R0603@1]
R61  10K  R0603  [R0603@1]
R62  4.7K  R0603  [R0603@1]
R63  100K  RES-0402  [R0402]
R64  100K  RES-0402  [R0402]
R65  0R  R0603  [R0603@1]
R66  10K  R0603  [R0603@1]
R67  10K  R0603  [R0603@1]
R68  100K  RES-0402  [R0402]
R69  2K  RES-0603  [R0603-SP]
R70  0R  RES-0402  [R0402]
R71  10K  R0603  [R0603@1]
R72  10K_NC  RES-0402  [R0402]
R73  10K_NC  RES-0402  [R0402]
R74  2K  R0603  [R0603@1]
R75  2K_NC  R0603  [R0603@1]
R76  0R  R0603  [R0603@1]
R77  10K  R0603  [R0603@1]
R78  4.7K  R0603  [R0603@1]
R79  OR_NC  RES-0603  [R0603-SP]
R80  0R  RES-0402  [R0402]
R81  51K  R  [0402]
R82  51K  R  [0402]
R83  51K  R  [0402]
R84  51K  R  [0402]
R85  51K  R  [0402]
R86  51K  R  [0402]
R87  10K  R0603  [R0603@1]
R88  0R  R0402-0402  [R0402]
R89  0R  R0402-0402  [R0402]
R90  0R  R0402-0402  [R0402]
R91  10K  R0603  [R0603@1]
R92  0R  RES-0402  [R0402]
R93  2K  R0603  [R0603@1]
R94  2K  R0603  [R0603@1]
R95  0R  RES-0402  [R0402]
R96  5.1K  R0603  [R0603@1]
R97  2K  R0603  [R0603@1]
R98  2K  R0603  [R0603@1]
R99  0R  RES-0402  [R0402]
R100  0R  RES-0402  [R0402]
R101  5.1K  R0603  [R0603@1]
R102  0R  RES-0402  [R0402]
R103  0R  R0603  [R0603@1]
R104  4.02K  RES-0402  [R0402]
R105  0R  RES-0402  [R0402]
R106  10K  R0603  [R0603@1]
R107  0R_NC  RES-0402  [R0402]
R108  100K  RES-0402  [R0402]
R109  0R  RES-0402  [R0402]
R110  0R_NC  RES-0402  [R0402]
R111  0R_NC  RES-0402  [R0402]
R112  22R  R0603  [R0603@1]
R113  22R  R0603  [R0603@1]
R114  22R  R0603  [R0603@1]
R115  22R  R0603  [R0603@1]
R116  10K  R0603  [R0603@1]
R117  100K  R0603  [R0603@1]
R118  0R  R0603  [R0603@1]
R119  0R  R0603  [R0603@1]
R120  5.1K_NC  R0603  [R0603@1]
R121  5.1K_NC  R0603  [R0603@1]
R122  100K  RES-0402  [R0402]
R123  100K  RES-0402  [R0402]
R124  0R_NC  RES-0402  [R0402]
R125  0R_NC  RES-0402  [R0402]
R126  0R_NC  RES-0402  [R0402]
R127  22R  RES-0402  [R0402]
R128  0R_NC  RES-0402  [R0402]
R129  22R  R0603  [R0603@1]
R130  0R_NC  RES-0402  [R0402]
R131  10K  RES-0402  [R0402]
R132  OR  RES-0402  [R0402]
R133  22R  R  [0402]
R134  OR  RES-0402  [R0402]
R135  22R  R  [0402]
R136  22R  R  [0402]
R137  22R  R  [0402]
R138  22R  R  [0402]
R139  100K  R0603  [R0603@1]
R140  10K  R  [0402]
R141  OR_NC  RES-0402  [R0402]
R142  OR_NC  RES-0402  [R0402]
R143  51K  RES-0603  [R0603-SP]
R144  OR_NC  RES-0402  [R0402]
R145  OR_NC  RES-0402  [R0402]
R146  0R_NC  RES-0402  [R0402]
R147  OR_NC  RES-0603  [R0603-SP]
R148  0R_NC  RES-0402  [R0402]
R149  22R  R0603  [R0603@1]
R150  0R  R  [0402]
R151  0R  R  [0402]
R152  100R  RES-0402  [R0402]
R153  100R  RES-0402  [R0402]
R154  100R  RES-0402  [R0402]
R155  100R  RES-0402  [R0402]
R156  100R  RES-0402  [R0402]
R157  100R  RES-0402  [R0402]
R158  4.02K  RES-0402  [R0402]
R159  1.1R  RES-0603  [R0603-SP]
R160  10K  R0603  [R0603@1]
R161  0R_NC  RES-0402  [R0402]
R162  22R  RES-0402  [R0402]
R163  NC  RES-0603  [R0603-SP]
R164  39k  R0603  [R0603@1]
R165  100K  R0603  [R0603@1]
R166  180K  R0603  [R0603]
R167  12K  R0603  [R0603]
R168  1.91K  RES-0402  [R0402]
R169  1K  RES-0402  [R0402]
R170  0R_NC  RES-0402  [R0402]
R171  10K  RES-0402  [R0402]
R172  220R  R0603  [R0603]
R173  51K  R0603  [R0603@1]
R174  220R  R0603  [R0603]
R175  51K  R0603  [R0603@1]
R177  0R_NC  RES-0402  [R0402]
R178  20K_NC  R0603  [R0603]
R179  20K_NC  R0603  [R0603]
R180  10K  R0603  [R0603@1]
R181  10K  R0603  [R0603@1]
R182  0R  L0805  [L0805]
R184  0R  R0603  [R0603@1]
R185  OR_NC  RES-0603  [R0603-SP]
R186  100k  R0603  [R0603@1]
R187  10k  R0603  [R0603@1]
R188  0R  R0603  [R0603@1]
R189  0R  R0603  [R0603@1]
R190  0R  RES-0402  [R0402]
R210  NC/10K  R0603  [R0603@1]
R216  0R  R  [0402]
R217  0R  R  [0402]
R332  0R  R  [0402]
R333  10K  RES-0402  [R0402]
SW1  switch_6pin  SWITCH_6PIN_2P  [SWITCH_6PIN_2P]
U1  CH340K  [ESOP-10-EP-150MIL]
U2  TP4059-SOT23-6  [SOT23-6L]
U3  NS4168  NS4168-ESOP-8  [NS4168-ESOP-8]
U4  NS4263B  [SOP16]
U6  MT9201  COOPER_MT9201  [COOPER_SOT23-6]
U7  ESP32-P4NRW32  [IC_ESP32-P4NRW32]
U8  UMH3NTN  [SOP65P210X100-6N]
U9  MT3406_C22462728  TLV62569DBVR  [SOT95P280X145-5N]
U10  MT3406_C22462728  TLV62569DBVR  [SOT95P280X145-5N]
U13  NS4168  NS4168-ESOP-8  [NS4168-ESOP-8]
U14  STC8H1K08-36I  [TSSOP20]
U16  MT3608  [SOT95P280X145-6N]
U176  LMA3526B381  [MIC-SMD_5P-L3.5-W2.7-P1.67]
Y2  40MHZ  X322540MPB4SI  [X322540MPB4SI]
Y3  24Mhz  24MHZ  [24MHZ_1631-24003-BTKEYA]
Y4  32.768K  NORDIC_NRF_XTAL_32KHZ  [NORDIC_NRF_XTAL_3215_N]

## Nets
3V3$: C2.2 U1.10(V3)
13: R189.2 U14.3(MISO/P1.4)
14: R188.2 U14.4(SCLK/P1.5)
+5V_IN: D2.+ D4.+ J10.3 P66.P$1 R46.1 R51.1
+VBUS1: D10.+ D11.+ J1.A4 J1.A9 J1.B4 J1.B9 P1.P$1
+VBUS2: D007.+ D008.+ J16.A4 J16.A9 J16.B4 J16.B9 P87.P$1
ADC_AVDD_3V3: C132.1 C133.2 FB5.2 IC5.22(VDDA) IC5.23(VDDM)
ADC_DVDD_3V3: C130.1 C131.2 FB4.2 IC5.6(VDDP) IC5.7(VDDD) R73.1
ADC_VBAT: C158.2 R164.2 R186.1 U14.13(P3.2/ADC10)
AGND: C102.2 C103.2 C104.2 C105.1 C106.1 C134.1 C143.1 C148.1 C154.2 FB19.2 FB21.2 J4.P$3 J4.P$4 R79.2 R143.1 R185.1 U4.2 U4.7 U4.15 U13.7(GND) U13.9(PE)
AGND1: C72.1 C117.1 C118.1 C119.1 C120.1 C121.1 C122.1 C127.2 C128.2 C129.2 C132.2 C133.1 C137.1 C138.2 C139.2 C142.2 IC5.21(GNDA) IC6.10(AGND) R144.1 R145.2 R171.2 R182.2 U176.5_1 U176.5_2
AGND3: C22.2 C23.2 C24.2 C67.1 C68.1 FB20.2 J6.P$3 J6.P$4 U3.7(GND) U3.9(PE)
AUDIO_CTRL: Q10.3(D) R117.2 R139.2
AUDIO_OUT_5V: C134.2 C148.2 C154.1 FB15.2 U4.4 U4.13
AUDIO_OUT_SD: Q10.1(G) R71.1 R147.1 U7.60(GPIO30)
AUDIO_VDD1: C102.1 C103.1 C104.1 FB17.1 U13.6(VDD)
AUDIO_VDD2: C22.1 C23.1 C24.1 FB18.1 U3.6(VDD)
AUDIO_VDD_3V3: C152.2 C153.2 FB4.1 FB5.1 FB6.1 FB14.1 FB16.2 IC7.5(VOUT)
AVDD_2V8: C82.2 C83.2 FPC3.1 FPC3.2 IC3.5(VOUT)
C6_EN: C15.1 IC1.8(EN) P37.P$1 R77.1 U7.63(GPIO32)
C6_IO8: IC1.22(IO8) R87.2
C6_IO9_BOOT: IC1.23(IO9) P36.P$1
C6_RXD0: IC1.30(RXD0) P21.P$1
C6_SD2_CLK: C25.2 IC1.25(IO19) R34.2 R82.2
C6_SD2_CMD: C160.2 IC1.24(IO18) R81.2 R133.2
C6_SD2_D0: C161.2 IC1.26(IO20) R83.2 R135.2
C6_SD2_D1: C162.2 IC1.27(IO21) R84.2 R136.2
C6_SD2_D2: C163.2 IC1.28(IO22) R85.2 R137.2
C6_SD2_D3: C164.2 IC1.29(IO23) R86.2 R138.2
C6_TXD0: IC1.31(TXD0) P25.P$1
C6_VDD_3V3: C11.1 C14.2 IC1.3(3V3) R76.1 R77.2 R81.1 R82.1 R83.1 R84.1 R85.1 R86.1 R87.1
CODEC_3V3: C145.1 C146.2 FB13.2 FB14.2 IC6.3(PVDD) IC6.4(DVDD)
CSI_CLK_N: FPC3.19 R156.2
CSI_CLK_P: FPC3.18 R157.2
CSI_D0_N: FPC3.16 R152.2
CSI_D0_P: FPC3.15 R153.2
CSI_D1_N: FPC3.22 R154.2
CSI_D1_P: FPC3.21 R155.2
CSI_RESET: FPC3.8 Q4.2(S) R57.2
CSI_SCL: FPC3.4 Q7.2(S) R62.2
CSI_SDA: FPC3.5 Q6.2(S) R56.2
CSID0_P: R153.1 U7.43(CSI_DATAP0)
DA1: J5.8(DATA1) P56.P$1 R15.1
DA2: J5.1(DATA2) P53.P$1 R30.1
DOVDD_1V8: C77.2 C78.2 C84.2 C85.2 FPC3.9 IC2.5(VOUT) Q4.1(G) Q6.1(G) Q7.1(G) R56.1 R57.1 R62.1 R67.2 Y3.4(4_VDD)
DOWNLOAD_BOOT: R60.1 R106.2
DSI_CLK_N: J21.18 R100.1
DSI_CLK_P: J21.17 R102.1
DSI_DATA0_N: J21.24 R190.1
DSI_DATA0_P: J21.23 R92.1
DSI_DATA1_N: J21.21 R95.1
DSI_DATA1_P: J21.20 R99.1
DTR: R5.2 U1.4(DTR#) U8.4(E2)
EN_DCDC: R13.2 U7.79(EN_DCDC)
ESP32_LDO1: C58.1 R105.2 U7.71(VFB1/VO1)
ESP32_LDO2: C57.1 R40.2 U7.72(VFB2/VO2)
ESP32_LDO3: C59.1 R80.2 U7.73(VFB3/VO3)
ESP32_LDO4: C66.1 R109.2 U7.74(VFB4/VO4)
FB_DCDC: C31.1 R14.2 R21.1 R103.1 U10.5(FB)
FLASH_CK: IC10.6(CLK) U7.32(FLASH_CK)
FLASH_CS: IC10.1(/CS) R333.1 U7.27(FLASH_CS)
FLASH_D: IC10.5(DI_(IO0)) U7.33(FLASH_D)
FLASH_HOLD: IC10.7(/HOLD_OR_/RESET_(IO3)) U7.31(FLASH_HOLD)
FLASH_Q: IC10.2(DO_(IO1)) U7.28(FLASH_Q)
FLASH_WP: IC10.3(/WP_(IO2)) U7.29(FLASH_WP)
GND: C1.1 C2.1 C3.1 C4.1 C5.2 C6.1 C7.2 C8.1 C9.2 C10.1 C11.2 C12.2 C13.2 C14.1 C15.2 C16.1 C17.1 C18.2 C19.2 C20.1 C21.1 C25.1 C27.1 C28.2 C29.2 C30.2 C32.1 C33.2 C34.1 C35.1 C36.2 C37.1 C38.1 C39.2 C40.2 C41.2 C42.1 C43.2 C44.1 C45.2 C46.2 C47.1 C48.1 C49.1 C50.2 C51.2 C52.1 C53.1 C54.1 C55.2 C56.1 C57.2 C58.2 C59.2 C60.2 C61.2 C62.2 C63.2 C64.2 C65.2 C66.2 C69.1 C70.2 C71.1 C73.2 C74.1 C75.1 C76.1 C77.1 C78.1 C79.1 C80.1 C81.1 C82.1 C83.1 C84.1 C85.1 C86.1 C87.1 C88.2 C90.2 C91.2 C92.2 C94.2 C95.2 C98.2 C99.2 C100.2 C107.1 C108.2 C109.2 C110.2 C111.2 C112.1 C113.2 C114.1 C115.2 C116.1 C130.2 C131.1 C136.1 C144.1 C145.2 C146.1 C149.1 C150.1 C151.1 C152.1 C153.1 C155.1 C156.1 C157.1 C158.1 C159.1 C160.1 C161.1 C162.1 C163.1 C164.1 C165.1 C166.1 C167.1 C168.1 C169.2 C170.1 C171.1 C172.1 C173.1 C174.1 C175.1 C176.1 D14.- D016.2 D018.1 D020.1 FB19.1 FB20.1 FB21.1 FPC2.4 FPC2.7 FPC2.8 FPC3.3 FPC3.6 FPC3.10 FPC3.12 FPC3.17 FPC3.20 FPC3.25 FPC3.26 IC1.1(GND_1) IC1.2(GND_2) IC1.11(GND_3) IC1.14(GND_4) IC1.36(GND_5) IC1.37(GND_6) IC1.38(GND_7) IC1.39(GND_8) IC1.40(GND_9) IC1.41(GND_10) IC1.42(GND_11) IC1.43(GND_12) IC1.44(GND_13) IC1.45(GND_14) IC1.46(GND_15) IC1.47(GND_16) IC1.48(GND_17) IC1.49(GND_18) IC1.50(GND_19) IC1.51(GND_20) IC1.52(GND_21) IC1.53(GND_22) IC1.54(GND_23) IC1.55(GND_24) IC1.56(GND_25) IC1.57(GND_26) IC1.58(GND_27) IC1.59(GND_28) IC1.60(GND_29) IC1.61(GND_30) IC2.2(VSS) IC3.2(VSS) IC4.2(VSS) IC5.8(GNDD) IC5.33(EP) IC6.5(DGND) IC6.20(CE) IC6.21(EP) IC7.2(VSS) IC8.2(VSS) IC10.4(GND) J1.A1 J1.A12 J1.B1 J1.B12 J1.P$1 J1.P$2 J1.P$3 J1.P$4 J2.4 J2.SS1 J2.SS2 J3.P$2 J3.P$3 J3.P$4 J5.6(VSS) J5.G1 J5.G2 J5.G3 J5.G4 J7.7 J7.8 J7.10 J7.21 J7.22 J7.23 J7.24 J8.4 J9.6 J9.6-6 J10.4 J10.5(SS1) J10.6(SS2) J12.P$1 J13.4 J13.SS1 J13.SS2 J14.P$1 J15.P$1 J16.A1 J16.A12 J16.B1 J16.B12 J16.P$1 J16.P$2 J16.P$3 J16.P$4 J18.P$1 J21.10 J21.13 J21.16 J21.19 J21.22 J21.25 J21.31 J21.32 K3.1 K4.1 P4.P$1 P10.P$1 P12.P$1 P14.P$1 P28.P$1 P31.P$1 P65.P$1 P88.P$1 R3.1 R4.2 R11.2 R16.1 R18.1 R21.2 R33.2 R64.1 R72.1 R96.1 R101.2 R104.1 R108.1 R123.1 R158.2 R159.1 R160.2 R163.1 R167.1 R169.1 R173.1 R175.1 R182.1 R186.2 SW1.1(1_2B) SW1.6(6_1B) U1.3(GND) U1.EP U2.2(GND) U6.2(2-GND) U7.105(GND) U9.2(GND) U10.2(GND) U14.10(GND) U16.2(2_GND) Y2.2(GND_1) Y2.4(GND_2) Y3.2(2_GND)
I2C1_SCL: FPC2.1 Q9.2(S) R97.2 U7.88(GPIO46)
I2C1_SCL_3V3: IC6.1(CCLK) J11.2 J11.2-2 J13.1 Q9.3(D) R93.2 R125.1 R188.1
I2C1_SDA: FPC2.2 Q8.2(S) R98.2 U7.87(GPIO45)
I2C1_SDA_3V3: IC6.19(CDATA) J11.3 J11.3-3 J13.2 Q8.3(D) R94.2 R124.1 R189.1
I2C2_SCL: Q7.3(D) R59.2 U7.14(GPIO13)
I2C2_SDA: Q6.3(D) R22.2 U7.13(GPIO12)
I2S_LRCK: R114.1 R130.1 R149.1 U7.23(GPIO21)
I2S_LRCK_N: IC5.10(LRCK) IC6.8(LRCK) R130.2
I2S_MCLK: R126.1 R127.1 U7.52(GPIO24)
I2S_MCLK_N: IC5.5(MCLK) IC6.2(MCLK) R126.2
I2S_SCLK: R113.1 R128.1 R129.1 U7.24(GPIO22)
I2S_SCLK_N: IC5.9(SCLK) IC6.6(SCLK/DMIC_SCL) R128.2
I2S_SDIN1_N: IC5.11(SDOUT1/TDMOUT)
I2S_SDIN2: R161.1 R162.1 U7.55(GPIO26)
I2S_SDIN2_N: IC5.12(SDOUT2/TDMIN) R161.2
I2S_SDOUT: R111.1 R112.1 R115.1 U7.25(GPIO23)
I2S_SDOUT_N: IC6.9(DSDIN) R111.2
I2SOUT_LRCK1: R149.2 U13.2(LRCLK)
I2SOUT_LRCK2: P35.P$1 R114.2 U3.2(LRCLK)
I2SOUT_SCLK1: R129.2 U13.3(BCLK)
I2SOUT_SCLK2: P34.P$1 R113.2 U3.3(BCLK)
I2SOUT_SD1: R112.2 U13.4(SDATA)
I2SOUT_SD2: P33.P$1 R115.2 U3.4(SDATA)
INLN: C147.1 R148.2
INLN1: R179.1 U4.6
INRN: C135.1 R146.2
INRN1: R178.1 U4.11
INT_TP: FPC2.3 R75.2 U7.83(GPIO42)
IO8: R217.1 U7.8(GPIO8)
IO9_W: C175.2 J11.5 J11.5-5 R150.2
IO10_W_BUSY: C174.2 J11.6 J11.6-6 R151.2
IO11_CSI_RESET: Q4.3(D) R58.2 U7.12(GPIO11)
LCD_AVDD_9V6: C92.1 C93.1 D005.2 D013.1 J21.9 P19.P$1 R166.2 R168.2
LCD_BK_EN: R160.1 U6.4(4-EN) U7.61(GPIO31)
LCD_BK_POWER: Q11.1(G) R180.1 U7.58(GPIO29)
LCD_BK_VDD: C13.1 C17.2 L5.1 Q11.3(D) R184.2 U6.6(6-VIN)
LCD_RESET: J21.27 R69.2 U7.82(GPIO41)
LCD_VCOM_3V3: C94.1 C95.1 J21.30 P20.P$1 R168.1 R169.2
LCD_VDD: C37.2 C38.2 C52.2 C53.2 IC4.5(VOUT) J21.28 J21.29 R63.2 R65.1 R68.2 R122.2
LCD_VGH_18V: C99.1 C100.1 D016.1 J21.3 P18.P$1 R172.1 R173.2
LCD_VGL_-6V: C110.1 C111.1 D020.2 J21.4 P77.P$1 R174.1 R175.2
LED+: C18.1 C19.1 D003.- D012.1 P63.P$1 R25.1 U6.5(5-OV)
LED-: J21.7 J21.8 P64.P$1 R159.2 R163.2 U6.3(3-FB)
MIC1N: C89.2
MIC1P: C101.2
MIC2_1: R132.2 R142.1 U176.1
MIC2_2: R131.1 R141.1 R145.1 R171.1 U176.2
MIC2_3: R134.1 R144.2 U176.3
MIC2_VDD_3V3: C72.2 FB6.2 U176.4
MIC2N: C125.2 R141.2
MIC2P: C126.2 R142.2
MIC3N: C124.1 R170.2
MIC3P: C123.1 R177.2
MIC_L/R: R131.2 U7.22(GPIO20)
MIC_MCLK: R127.2 R134.2
MIC_SD2: R132.1 R162.2
N$1: R1.1 U9.1(EN)
N$2: L1.1 U9.3(SW)
N$3: FB7.1 U4.12
N$4: FB10.1 U13.8(VOP)
N$5: R6.1 U1.1(UD+)
N$6: R7.1 U1.2(UD-)
N$7: R5.1 U8.2(B1)
N$8: R9.1 U8.5(B2)
N$9: J1.B5 R3.2
N$10: R8.2 U1.9(RXD)
N$11: R10.2 U1.8(TXD)
N$12: R16.2 U2.6(PRO)
N$13: C26.1 R2.2 R11.1 U9.5(FB)
N$14: L6.1 U10.3(SW)
N$15: C151.2 IC7.3(CE) R181.1
N$16: R13.1 R210.2 U10.1(EN)
N$17: C143.2 U4.10
N$18: R185.2 U4.8
N$19: D1.3 R31.1 R121.1
N$20: D1.4 R32.1 R120.1
N$21: D14.+ R26.1
N$22: J21.1 J21.2 R25.2
N$23: C173.2 J9.1 J9.1-1 R49.1
N$24: C176.2 J11.1 J11.1-1 R48.1
N$25: FB8.1 U4.14
N$26: Q5.4(4_G) R78.1 SW1.2(2_COM2) SW1.5(5_COM1)
N$27: J1.A5 R4.1
N$28: R79.1 U4.16
N$29: C28.1 R24.1 R210.1 U10.4(VIN)
N$31: R150.1 U7.10(GPIO9)
N$32: R190.2 U7.40(DSI_DATAN0)
N$33: R92.2 U7.39(DSI_DATAP0)
N$34: C30.1 R35.1 U7.1(GPIO1) Y4.2
N$35: C29.1 R35.2 U7.104(GPIO0) Y4.1
N$36: R95.2 U7.36(DSI_DATAN1)
N$37: R99.2 U7.35(DSI_DATAP1)
N$38: R100.2 U7.37(DSI_CLKN)
N$39: C147.2 R179.2
N$40: R102.2 U7.38(DSI_CLKP)
N$41: R103.2 U7.78(FB_DCDC)
N$42: R104.2 U7.34(DSI_REXT)
N$43: C21.2 IC4.3(CE) R53.1
N$44: C135.2 R178.2
N$45: FB2.1 U3.8(VOP)
N$46: FB11.1 U13.5(VON)
N$47: FB3.1 U3.5(VON)
N$48: R117.1 U3.1(CTRL)
N$49: R118.2 U14.12(P3.1/ADC9)
N$50: R119.2 U14.11(P3.0/ADC8)
N$51: R139.1 R143.2 U13.1(CTRL)
N$52: IC5.3(CDATA) R124.2
N$53: IC5.4(CCLK) R125.2
N$54: FB9.1 U4.3
N$55: C155.2 IC8.3(CE) R116.1
N$56: C159.2 R187.2 U14.7(NRST/PWM6/P5.4)
N$57: R151.1 U7.11(GPIO10)
N$58: FB12.1 U4.5
N$59: C124.2 IC5.32(MIC3N)
N$60: C89.1 IC5.15(MIC1N)
N$61: C101.1 IC5.16(MIC1P)
N$63: R332.1 U7.7(GPIO7)
N$64: R216.1 U7.6(GPIO6)
N$68: R158.1 U7.48(CSI_REXT)
N$69: R157.1 U7.44(CSI_CLKP)
N$70: R156.1 U7.45(CSI_CLKN)
N$71: R155.1 U7.47(CSI_DATAP1)
N$72: R154.1 U7.46(CSI_DATAN1)
N$73: R152.1 U7.42(CSI_DATAN0)
N$75: J16.B5 R96.2
N$76: J16.A5 R101.1
N$80: C123.2 IC5.31(MIC3P)
N$81: C122.2 IC5.30(REFQ34)
N$82: C121.2 IC5.29(REFP34)
N$83: C76.2 IC2.3(CE) R61.1
N$84: C81.2 IC3.3(CE) R66.1
N$85: C86.2 R67.1 Y3.1(1_EN)
N$86: C120.2 IC5.28(MIC4P)
N$87: C119.2 IC5.27(MIC4N)
N$88: C118.2 IC5.26(MICBIAS34)
N$89: C117.2 IC5.25(REFQM)
N$90: C129.1 IC5.24(MICBIAS12)
N$94: C125.1 IC5.20(MIC2N)
N$95: C126.1 IC5.19(MIC2P)
N$96: C127.1 IC5.18(REFQ12)
N$97: C128.1 IC5.17(REFP12)
N$100: R147.2 U4.1
N$102: C97.2 D017.1 D018.2
N$103: IC5.1(AD0) R73.2
N$104: IC5.2(AD1) R72.2
N$108: C139.1 IC6.14(DACVREF)
N$112: C137.2 IC6.16(VMID)
N$113: C138.1 IC6.15(ADCVREF)
N$115: C140.1 IC6.13(OUTN)
N$116: C141.1 IC6.12(OUTP)
N$117: C142.1 FB13.1 IC6.11(AVDD)
N$121: D003.+ D012.2 L5.2 U6.1(1-SW)
N$122: C96.1 C97.1 D013.2 L2.2 U16.1(1_SW)
N$124: R165.2 U16.4(4_EN)
N$125: C96.2 D005.1 D015.2
N$126: C93.2 R166.1 R167.2 U16.3(3_FB)
N$129: C98.1 D015.1 R172.2
N$130: C140.2 R146.1 R170.1
N$131: C109.1 D017.2 R174.2
N$132: C141.2 R148.1 R177.1
P4_IO2: J7.9 U7.2(GPIO2)
P4_IO3: J7.11 U7.3(GPIO3)
P4_IO4: J7.13 U7.4(GPIO4)
P4_IO5: J7.15 U7.5(GPIO5)
P4_IO25: J7.17 U7.53(GPIO25)
P4_IO35: R55.2 U7.66(GPIO35)
P4_IO36: R60.2 U7.68(GPIO36)
P4_IO39: R90.2 U7.80(GPIO39)
P4_IO43: R88.2 U7.84(GPIO43)
P4_IO44: R89.2 U7.86(GPIO44)
P4_IO49: J7.19 U7.92(GPIO49)
P4_IO50: J7.20 U7.93(GPIO50)
P4_IO51: J7.18 U7.94(GPIO51)
P4_IO52: J7.16 U7.95(GPIO52)
P4_IO53: J7.14 U7.97(GPIO53)
P4_IO54: J7.12 U7.98(GPIO54)
P4_RST_EN: C35.2 K4.2 R54.2 U7.103(CHIP_PU) U8.6(C1)
P4_RXD2: R48.2 U7.57(GPIO28)
P4_TXD2: R49.2 U7.56(GPIO27)
P4_VBAT: C9.1 C42.2 R20.1 U7.102(VBAT)
POWER_CHRG: R50.1 R120.2 U2.1(CHG) U14.14(P3.3/ADC11)
POWER_DONE: R47.1 R121.2 U2.5(STD) U14.15(P3.4/ADC11)
POWER_G_LED: R31.2 U14.17(P3.6/ADC14)
POWER_R_LED: R32.2 U14.16(P3.5/ADC13)
RESET_TP: FPC2.6 R74.2 U7.81(GPIO40)
RTS: R9.2 U1.6(RTS#) U8.1(E1)
RXD0: R10.1 U7.70(GPIO38)
RXD1: J2.1 P39.P$1 U7.90(GPIO48)
RXD3: Q2.2(S) R45.2 U7.64(GPIO33)
SD1_CMD: C166.2 J5.3(DI) P8.P$1 R28.1 R89.1
SD1_D0: C168.2 J5.7(DO) P6.P$1 R27.1 R90.1
SD1_SCK: C167.2 J5.5(SCLK) P7.P$1 R88.1 R140.1
SD2_CLK: R34.1 U7.19(GPIO18)
SD2_CMD: R133.1 U7.20(GPIO19)
SD2_D0: R135.1 U7.18(GPIO17)
SD2_D1: R136.1 U7.17(GPIO16)
SD2_D2: R137.1 U7.16(GPIO15)
SD2_D3: R138.1 U7.15(GPIO14)
SDCS: C165.2 J5.2(CS) P57.P$1 R29.1 R33.1
SHLR: J21.6 R122.1 R123.2
SPI2_MISO: C171.2 J9.3 J9.3-3 R332.2
SPI2_MOSI: C170.2 J9.4 J9.4-4 R216.2
SPI2_SCK: C172.2 J9.2 J9.2-2 R217.2
SPI_BOOT: C54.2 K3.2 R55.1 R91.2 U8.3(C2)
STBYB: J21.26 R63.1 R64.2
STC8_RXD: J8.2 R119.1
STC8_TXD: J8.1 R118.1
STC8_VDD_3V3: C69.2 C156.2 C157.2 IC8.5(VOUT) J8.3 R187.1 U14.8(VCC) U14.9(VREF)
TXD0: R8.1 U7.69(GPIO37)
TXD1: J2.2 P38.P$1 U7.89(GPIO47)
TXD3: Q1.2(S) R52.2 U7.65(GPIO34)
UART_IN_RXD3: J10.2 P67.P$1 Q2.3(D) R46.2
UART_IN_TXD3: J10.1 P68.P$1 Q1.3(D) R51.2
UPDN: J21.5 R68.1 R108.2
USB1_D+: J1.A6 J1.B6 P2.P$1 R6.2
USB1_D-: J1.A7 J1.B7 P3.P$1 R7.2
USB2_D+: J16.A6 J16.B6 U7.50(DP)
USB2_D-: J16.A7 J16.B7 U7.49(DM)
VBAT: C4.2 J3.P$1 P9.P$1 Q3.5(5_D) Q3.6(6_D) Q3.7(7_D) Q3.8(8_D) Q3.9(9_D) R17.1 R164.1 U2.3(BAT)
VCC5V: C136.2 C144.2 D1.1 D1.2 D2.- D007.- D10.- IC8.1(VIN) P11.P$1 Q3.1(1_S) Q3.2(2_S) Q3.3(3_S) Q5.1(1_S) Q5.2(2_S) Q5.3(3_S) R78.2 R116.2
VCC5V_IN: C3.2 D4.- D008.- D11.- Q3.4(4_G) R17.2 R18.2 R47.2 R50.2 U2.4(VCC)
VCCA: C43.1 C47.2 R23.1 U7.51(VCCA)
VDD5V: C12.1 C74.2 C75.2 C79.2 C80.2 C90.1 C91.1 C149.2 C150.2 FB15.1 FB17.2 FB18.2 IC2.1(VIN) IC3.1(VIN) IC7.1(VIN) J7.2 J7.4 J7.6 L2.1 L4.2 P5.P$1 Q5.5(5_D) Q5.6(6_D) Q5.7(7_D) Q5.8(8_D) Q5.9(9_D) Q11.2(S) R1.2 R24.2 R26.2 R61.2 R66.2 R165.1 R180.2 R181.2 R184.1 U9.4(VIN) U16.5(5_IN)
VDD5V_W: C88.1 J9.7 J9.7-7 L4.1
VDD_1V2: C31.2 C32.2 L6.2 P24.P$1 R14.1 R42.2 R43.2 R44.2
VDD_3V3: C1.2 C10.2 C16.2 C20.2 C26.2 C27.2 FB16.1 FPC2.5 IC4.1(VIN) J2.3 J5.4(VDD) J7.1 J7.3 J7.5 J13.3 L1.2 L3.2 P13.P$1 P15.P$1 P17.P$1 Q1.1(G) Q2.1(G) Q10.2(S) R2.1 R12.2 R15.2 R19.2 R20.2 R22.1 R23.2 R27.2 R28.2 R29.2 R30.2 R36.2 R37.2 R38.2 R39.2 R41.2 R45.1 R52.1 R53.2 R54.1 R58.1 R59.1 R65.2 R70.2 R71.2 R76.2 R91.1 R93.1 R94.1 R106.1 R107.2 R110.2 R140.2 U1.7(VCC)
VDD_3V3_A: C70.1 C169.1 J9.5 J9.5-5 L3.1
VDD_FLASH: C39.1 C40.1 C51.1 IC10.8(VCC) R105.1 R107.1 R333.2
VDD_HP_0: C108.1 C112.2 R42.1 U7.26(VDD_HP_0)
VDD_HP_2: C113.1 C114.2 R43.1 U7.76(VDD_HP_2)
VDD_HP_3: C115.1 C116.2 R44.1 U7.91(VDD_HP_3)
VDD_MIPI_DPHY: C62.1 C63.1 C64.1 R80.1 U7.41(VDD_MIPI_DPHY)
VDDA: C7.1 C8.2 R19.1 U7.101(VDDA)
VDDPST: C36.1 C55.1 R40.1 R110.1 U7.59(VDDPST) U7.67(VDDPST)
VDDPST_1: C73.1 C107.2 R36.1 U7.9(VDDPST_1)
VDDPST_2: C41.1 C44.2 R37.1 U7.21(VDDPST_2)
VDDPST_3: C45.1 C49.2 R38.1 U7.30(VDDPST_3)
VDDPST_4: C50.1 C56.2 R39.1 U7.62(VDDPST_4)
VDDPST_5: C60.1 C65.1 Q8.1(G) Q9.1(G) R69.1 R74.1 R75.1 R97.1 R98.1 R109.1 U7.85(VDDPST_5)
VDDPST_6: C61.1 C71.2 R41.1 U7.96(VDDPST_6)
VDDPST_DCDC: C5.1 C6.2 R12.1 U7.77(VDDPST_DCDC)
VDDPST_LDO: C46.1 C48.2 R70.1 U7.75(VDDPST_LDO)
VOLN: C106.2 FB11.2 FB12.2 J4.P$2 P55.P$1
VOLP: C105.2 FB9.2 FB10.2 J4.P$1 P54.P$1
VORN: C68.2 FB3.2 FB7.2 J6.P$2 P32.P$1
VORP: C67.2 FB2.2 FB8.2 J6.P$1 P26.P$1
XTAL_N: C34.2 U7.99(XTAL_N) Y2.3(CRYSTAL_2)
XTAL_P: C33.1 U7.100(XTAL_P) Y2.1(CRYSTAL_1)
XVCLK: C87.2 FPC3.11 Y3.3(3_OUT)
Unconnected: FPC3.7 FPC3.13 FPC3.14 FPC3.23 FPC3.24 IC1.4(NC_1) IC1.5(IO2) IC1.6(IO3) IC1.7(NC_2) IC1.9(IO4) IC1.10(IO5) IC1.12(IO0) IC1.13(IO1) IC1.15(IO6) IC1.16(IO7) IC1.17(IO12) IC1.18(IO13) IC1.19(IO14) IC1.20(IO15) IC1.21(NC_3) IC1.32(NC_4) IC1.33(NC_5) IC1.34(NC_6) IC1.35(NC_7) IC2.4(NC) IC3.4(NC) IC4.4(NC) IC5.13(INT) IC5.14(DMIC_CLK) IC6.7(ASDOUT) IC6.17(MIC1N) IC6.18(MIC1P/DMIC_SDA) IC7.4(NC) IC8.4(NC) J1.A8 J1.B8 J5.9(CDN) J11.4 J11.4-4 J11.7 J11.7-7 J16.A8 J16.B8 J21.11 J21.12 J21.14 J21.15 SW1.3(3_2A) SW1.4(4_1A) U1.5(CTS#) U4.9 U7.54(NC) U14.1(SS/P1.2) U14.2(MOSI/P1.3) U14.5(XTALO/P1.6) U14.6(XTALI/P1.7) U14.18(P3.7/INT3) U14.19(P1.0/ADC0) U14.20(P1.1/ADC1) U16.6(6_NC)

## Notes on the sheet
- USB interface | USB TO UART | UART & I2C & GPIO extensions
- ESP32-C6
- 7.0 inch IPS interface
- UART_5V_IN | UART0_OUT
- I2C_OUT
- Battery and control
- BOOT
- CSI_Interface | ESP32-P4
- HIG: SPI Boot
- LOW: Download Boot
- RESET
- HIG: ESP32-P4 Enable | LCD_POWER
- LOW: ESP32-P4 Off
- Power_LED | SD card
- Charge indicator control
- Power SW
- ESP32-P4_POWER
- Wireless module
- DC-DC:5V to 3V3 | DC-DC:5V to 1V2 | LDO:5V to 3V3(AUDIO POWER)
- DSI_LED Driver
- 2A
- 2A
- I led=200mV/1.1=182mA
- PDM MIC | Audio_ADC/DAC
- Audio_OUT
- Simulated microphone U176 usage LMA3526B381，Welding R142,R141,R145,R144, NC:R132,R134,R131,R171
  The digital microphone U176 usage LMD3526B381，Welding R132,R134,R131,R171, NC:R142,R141,R145,R144
- NC
- NC
- NC

## Library data of the parts
C1-C4 C11 C12 C14-C17 C19-C22 C27 C28 C32 C35 C37 C38 C52-C54 C67-C70 C74-C88 C90 C91 C93 C96-C100 C102 C105 C106 C109-C111 C136 C144 C149-C159 C169 = RC:C0603
C5-C9 C29 C30 C33 C34 C36 C39-C51 C55-C66 C71-C73 C89 C94 C95 C101 C107 C108 C112-C133 C137-C142 C145 C146 R23 = LoraWAN_Gateway_Mainboard:CAP*
C10 C25 C160-C168 C170-C176 = RC:CAP: Ceramic Capacitors
C13 C18 C92 = RC:C0805
C23 C24 C26 C31 C103 C104 C134 C135 C143 C147 C148 = cooper:C0603
D1 = KT-0603RYG:KT-0603RYG: Check availability <https://pricing.snapeda.com/parts/KT-0603R/Hubei%20KENTO%20Elec/view-part?ref=eda>
D2 D003 D4 D007 D008 D10 D11 = CrowPanel_Advance_HMI:DIODE*
D005 D012 D013 D015 D017 D018 = LMBR140ET1G:LMBR140ET1G
D14 = CrowPanel_Advance_HMI:LED-SMT*
D016 D020 = LMSZ5233BT1G_MM1W18:LMSZ5233BT1G
FB2 FB3 FB7-FB12 FB15-FB20 = CrowPanel_Advance_HMI:FB*
FB4-FB6 FB13 FB21 R182 = LoraWAN_Gateway_Mainboard:L*
FB14 R12 R19 R20 R25 R35-R44 R63 R64 R68-R70 R72 R73 R80 R92 R95 R99 R100 R102 R104 R105 R107-R111 R122-R128 R130-R132 R134 R141 R142 R144-R146 R148 R152-R158 R161 R162 R168-R171 R177 R190 R333 = LoraWAN_Gateway_Mainboard:RES*
FPC2 = CrowPanel_Advance_HMI:FPC-6PIN-0.5MM
FPC3 = FPC:AFC24-S24FIA-00
IC1 = ESP32-C6-MINI-1-N4:ESP32-C6-MINI-1-N4: Multiprotocol Modules ESP32-C6 Module, supports Wi-Fi 6 in 2.4 GHz band, Bluetooth 5, Zigbee 3.0 and Thread - -40 to 105C Source: Datasheet <https://www.espressif.com/sites/default/files/documentation/esp32-c6-mini-1_mini-1u_datasheet_en.pdf>; DESCRIPTION: Multiprotocol Modules ESP32-C6 Module, supports Wi-Fi 6 in 2.4 GHz band, Bluetooth 5, Zigbee 3.0 and Thread - -40 to 105C; HEIGHT: mm; MANUFACTURER_NAME: Espressif Systems; MANUFACTURER_PART_NUMBER: ESP32-C6-MINI-1-N4; MOUSER_PART_NUMBER: 356-ESP32C6MINI-1-N4; MOUSER_PRICE-STOCK: https://www.mouser.co.uk/ProductDetail/Espressif-Systems/ESP32-C6-MINI-1-N4?qs=Jm2GQyTW%2FbjiJX9bVadqSw%3D%3D
IC2-IC4 IC7 IC8 = ME6211C18M(22M)5G-N:ME6211C18M5G-N: High Speed LDO Regulators, High PSRR, Low noise Source: Datasheet <https://datasheet.lcsc.com/lcsc/1809141122_MICRONE-Nanjing-Micro-One-Elec-ME6211C18M5G-N_C236671.pdf>; DESCRIPTION: High Speed LDO Regulators, High PSRR, Low noise; HEIGHT: 1.45mm; MANUFACTURER_NAME: Micron; MANUFACTURER_PART_NUMBER: ME6211C18M5G-N
IC5 = ES7210:ES7210: High Performance Four Channels Audio ADC Source: Datasheet <http://www.everest-semi.com/pdf/ES7210 PB.pdf>; DESCRIPTION: High Performance Four Channels Audio ADC; HEIGHT: 0.8mm; MANUFACTURER_NAME: Everest; MANUFACTURER_PART_NUMBER: ES7210
IC6 = ES8311:ES8311: Low Power Mono Audio CODEC Source: Datasheet <http://www.everest-semi.com/pdf/ES8311 PB.pdf>; DESCRIPTION: Low Power Mono Audio CODEC; HEIGHT: 0.6mm; MANUFACTURER_NAME: Everest; MANUFACTURER_PART_NUMBER: ES8311
IC10 = W25Q128JVSIQ:W25Q128JVSIQ: 128M-bit Serial Flash Memory with uniform 4KB sectors and Dual/Quad SPI Source: Datasheet <https://www.winbond.com/hq/search-resource-file.jsp?partNo=W25Q128JVSIQ&type=datasheet>; ARROW_PART_NUMBER: W25Q128JVSIQ; ARROW_PRICE-STOCK: https://www.arrow.com/en/products/w25q128jvsiq/winbond-electronics?utm_currency=USD&region=nac; DESCRIPTION: 128M-bit Serial Flash Memory with uniform 4KB sectors and Dual/Quad SPI; HEIGHT: 2.16mm; MANUFACTURER_NAME: Winbond; MANUFACTURER_PART_NUMBER: W25Q128JVSIQ; MOUSER_PART_NUMBER: 454-W25Q128JVSIQ; MOUSER_PRICE-STOCK: https://www.mouser.co.uk/ProductDetail/Winbond/W25Q128JVSIQ?qs=qSfuJ%252Bfl%2Fd6tLXvPR4fl9w%3D%3D
J1 J16 = CrowPanel_Advance_HMI:TYPEC-3.0-16P-SMD
J2 J13 = CrowPanel_Advance_HMI:CONNECTOR_TWIG-4P-2.0-SMD-FEMALE-REINFORCE
J3 J4 J6 = CrowPanel_Advance_HMI:PH2.0WT-2PIN
J5 = CrowPanel_Advance_HMI:HOLDER-MICROSD-9P
J7 = SparkFun-Connectors2.6:CONN_12X2: Multi connection point. Often used as Generic Header-pin footprint for 0.1 inch spaced/style header connections On any of the 0.1 inch spaced packages, you can populate with these: Break Away Headers - Straight <https://www.sparkfun.com/products/116> (PRT-00116) Break Away Male Headers - Right Angle <https://www.sparkfun.com/products/553> (PRT-00553) Female Headers <https://www.sparkfun.com/products/115> (PRT-00115) Break Away Headers - Machine Pin <https://www.sparkfun.com/products/117> (PRT-00117) Break Away Female Headers - Swiss Machine Pin <https://www.sparkfun.com/products/743> (PRT-00743)
J8 = Mini PC Case:HC-PZ200-8.7L-1X4PZ
J9 J11 = CrowPanel_Advance_HMI:HEADER-7P
J10 = CrowPanel_Advance_HMI:XH2.54-4P-SMT
J12 J14 J15 J18 = CrowPanel_Advance_HMI:THO-M3.2*5MM-HOLE
J21 = FPC:C23398852_30P_0.5MM_下接_FC-05A30P11H20
K3 K4 = CrowPanel_Advance_HMI:KEY-6
L1 L2 L5 L6 = SparkFun-Coils:4.7μH_SHIELDED_INDUCTOR: 4.7uH Inductor 4.7uH 1.4A 50mOhm 1008(2520) Package Shielded; PROD_ID: NDUC-14880
L3 L4 = CrowPanel_Advance_HMI:L*
P1-P15 P17-P21 P24-P26 P28 P31-P39 P53-P57 P63-P68 P77 P87 P88 = CrowPanel_Advance_HMI:TEST_PAD*
Q1 Q2 Q4 Q6-Q9 = CrowPanel_Advance_HMI:MOSFET-N*: IRLL014: http://www.vishay.com/docs/91319/sihll014.pdf
Q3 Q5 = MY_LIB:RU30L30M
Q10 Q11 = CrowPanel_Advance_HMI:MOSFET-P: IRLL014: http://www.vishay.com/docs/91319/sihll014.pdf
R1-R10 R13 R17 R18 R22 R24 R26 R45-R47 R50-R62 R65-R67 R71 R74-R78 R87 R91 R93 R94 R96-R98 R101 R103 R106 R112-R121 R129 R139 R149 R160 R164 R165 R173 R175 R180 R181 R184 R186-R189 R210 = RC:R0603
R11 R14 R21 R166 R167 R172 R174 R178 R179 = cooper:R0603
R15 R27-R30 R33 R34 R48 R49 R81-R86 R133 R135-R138 R140 R150 R151 R216 R217 R332 = RC:R*
R16 R31 R32 R79 R143 R147 R159 R163 R185 = CrowPanel_Advance_HMI:RES*
R88-R90 = RC:R0402
SW1 = cooper:SWITCH_6PIN_2P
U1 = sale:CH340K
U2 = CrowPanel_Advance_HMI:TP4059-SOT23-6
U3 U13 = STC_MCUSTC8G1K08A:NS4168-ESOP-8
U4 = brain1:NS4263B
U6 = CrowPanel_Advice_HMI 4.3:COOPER_MT9201
U7 = ESP32-P4NRW32:ESP32-P4NRW32: Check availability <https://pricing.snapeda.com/parts/ESP32-P4NRW32/Espressif%20Systems/view-part?ref=eda>; AVAILABILITY: Not in stock; CHECK_PRICES: https://www.snapeda.com/parts/ESP32-P4NRW32/Espressif+Systems/view-part/?ref=eda; DESCRIPTION: 高性能 MCU，带有一个 RISC-V 32 位双核微处理器; MF: Espressif Systems; MP: ESP32-P4NRW32; PACKAGE: None; PRICE: None; SNAPEDA_LINK: https://www.snapeda.com/parts/ESP32-P4NRW32/Espressif+Systems/view-part/?ref=snap
U8 = UMH3NTN:UMH3NTN: Dual NPN BJT with 4.7K Base resistor Datasheet <https://fscdn.rohm.com/en/products/databook/datasheet/discrete/transistor/digital/umh3ntn-e.pdf> BUY NOW <https://www.digikey.ca/en/products/detail/rohm-semiconductor/umh3ntn/659279> Check availability <https://pricing.snapeda.com/parts/UMH3NTN/Rohm/view-part?ref=eda>; AVAILABILITY: In Stock; CHECK_PRICES: https://www.snapeda.com/parts/UMH3NTN/Rohm/view-part/?ref=eda; DESCRIPTION: Pre-Biased Bipolar Transistor (BJT) 2 NPN - Pre-Biased (Dual) 50V 100mA 250MHz 150mW Surface Mount UMT6; MF: Rohm; MP: UMH3NTN; PACKAGE: SOT-363 Rohm; PRICE: None; PURCHASE-URL: https://www.snapeda.com/api/url_track_click_mouser/?unipart_id=355768&manufacturer=Rohm&part_name=UMH3NTN&search_term=umh3n; SNAPEDA_LINK: https://www.snapeda.com/parts/UMH3NTN/Rohm/view-part/?ref=snap
U9 U10 = TLV62569DBVR:TLV62569DBVR: Check availability <https://pricing.snapeda.com/parts/TLV62569DBVR/Texas%20Instruments/view-part?ref=eda>; AVAILABILITY: In Stock; CHECK_PRICES: https://www.snapeda.com/parts/TLV62569DBVR/Texas+Instruments/view-part/?ref=eda; DESCRIPTION: 2.5V-5.5V input, 2-A high efficiency step-down buck converter in SOT23 and SOT563 package; MF: Texas Instruments; MP: TLV62569DBVR; PACKAGE: SOT-23-5 Texas Instruments; PRICE: None; SNAPEDA_LINK: https://www.snapeda.com/parts/TLV62569DBVR/Texas+Instruments/view-part/?ref=snap
U14 = MY_LIB:STC8H1K08-36I
U16 = MT3608:MT3608: High Efficiency 1.2MHz 2A Step Up Converter Source: Datasheet <https://www.olimex.com/Products/Breadboarding/BB-PWR-3608/resources/MT3608.pdf>; DESCRIPTION: High Efficiency 1.2MHz 2A Step Up Converter; HEIGHT: 1.45mm; MANUFACTURER_NAME: Aerosemi; MANUFACTURER_PART_NUMBER: MT3608
U176 = LMA3526B381:LMA3526B381
Y2 = X322540MPB4SI_40MHZ:X322540MPB4SI: SMD Crystal Resonators 40MHz +/-10ppm SMD-3225_4P RoHS Source: Datasheet <https://datasheet.lcsc.com/szlcsc/Yangxing-Tech-X322540MPB4SI_C9010.pdf>; DESCRIPTION: SMD Crystal Resonators 40MHz +/-10ppm SMD-3225_4P RoHS; HEIGHT: 0.8mm; MANUFACTURER_NAME: Yangxing Tech; MANUFACTURER_PART_NUMBER: X322540MPB4SI
Y3 = 24MHZ_1631-24003-BTKEYA:24MHZ
Y4 = nRF52832_MCU:NORDIC_NRF_XTAL_32KHZ